# Altium project ZMBo.PrjPcb
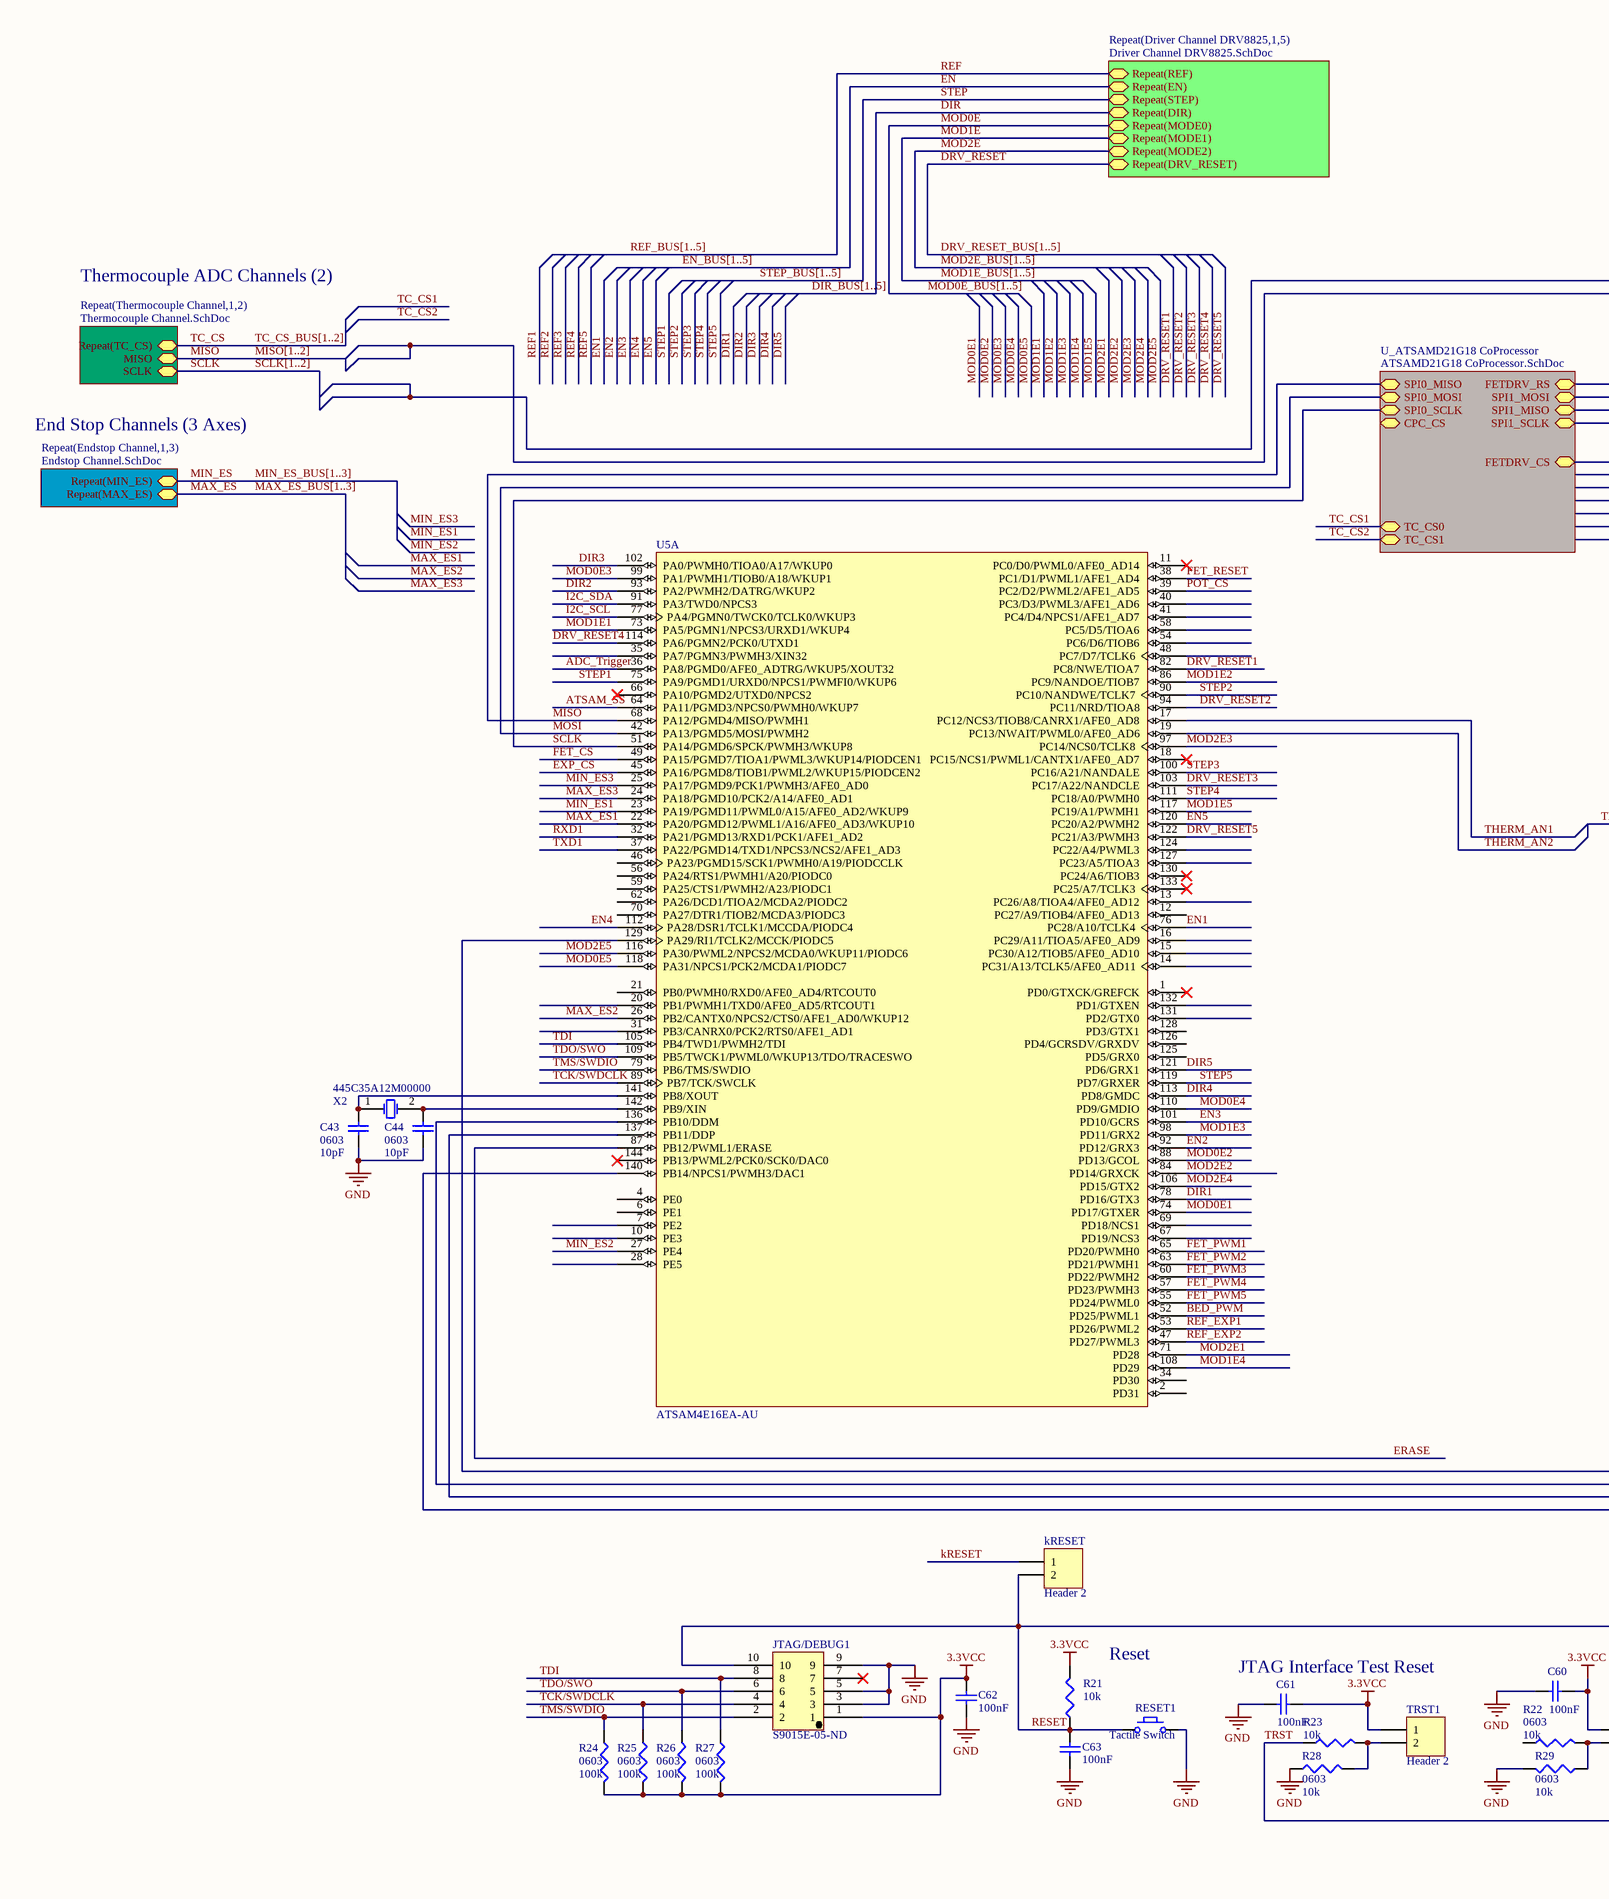
[diagram p0: ATSAM4E16EA_AU Main Controller.SchDoc, left]
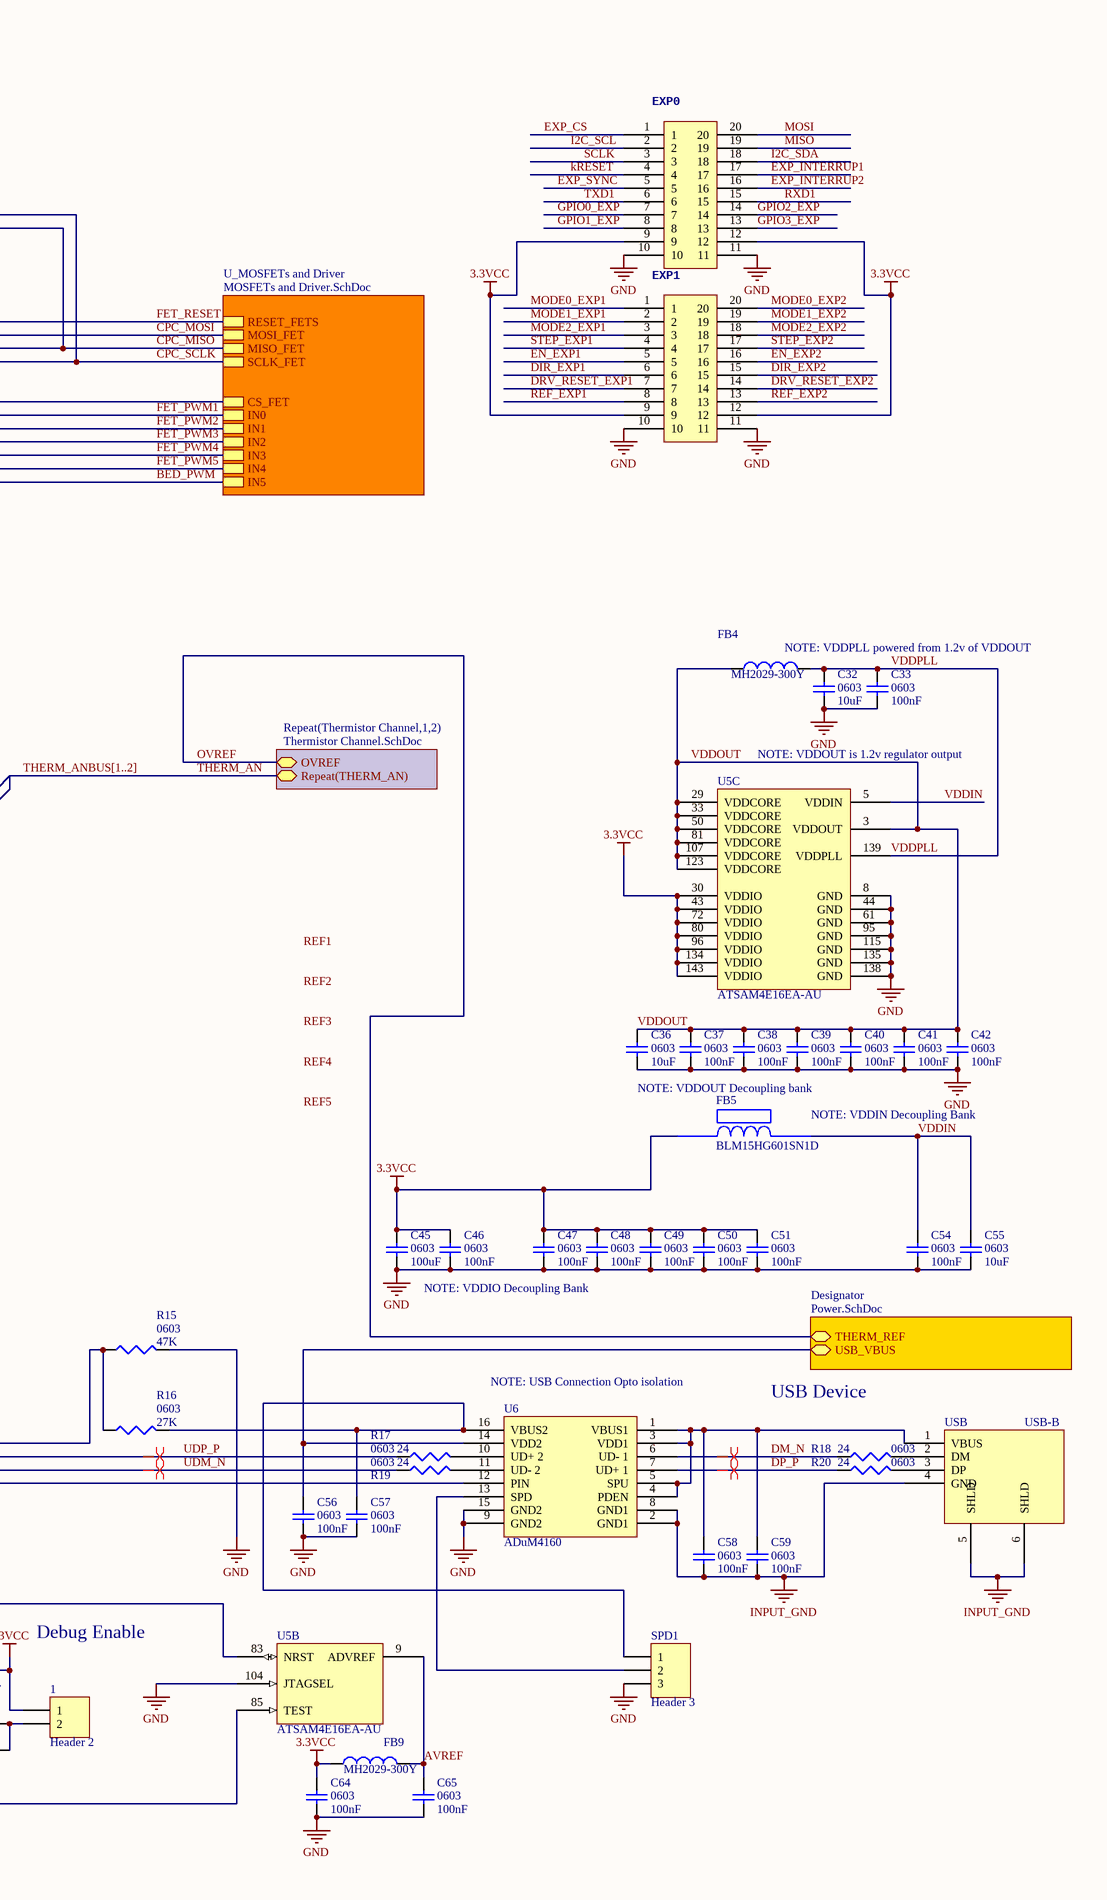
[diagram p1: ATSAM4E16EA_AU Main Controller.SchDoc, right]
8 sheets, 253 parts. Net scope: hierarchical (ports join the sheet entries above them; power ports are global).
Board file: Tigershark 3D R1.3.PcbDoc
Sheets:
  ATSAM4E16EA_AU Main Controller.SchDoc
    Thermistor Channel1 = Thermistor Channel.SchDoc
    Thermistor Channel2 = Thermistor Channel.SchDoc
    Designator = Power.SchDoc
    Thermocouple Channel1 = Thermocouple Channel.SchDoc
    Thermocouple Channel2 = Thermocouple Channel.SchDoc
    Endstop Channel1 = Endstop Channel.SchDoc
    Endstop Channel2 = Endstop Channel.SchDoc
    Endstop Channel3 = Endstop Channel.SchDoc
    Driver Channel DRV88251 = Driver Channel DRV8825.SchDoc
    Driver Channel DRV88252 = Driver Channel DRV8825.SchDoc
    Driver Channel DRV88253 = Driver Channel DRV8825.SchDoc
    Driver Channel DRV88254 = Driver Channel DRV8825.SchDoc
    Driver Channel DRV88255 = Driver Channel DRV8825.SchDoc
    U_MOSFETs and Driver = MOSFETs and Driver.SchDoc
    U_ATSAMD21G18 CoProcessor = ATSAMD21G18 CoProcessor.SchDoc

## Sheet ATSAM4E16EA_AU Main Controller.SchDoc
size C

### Parts
1  Header 2  [HDR1X2]
C32  0603  value 10uF  [1608[0603]]
C33  0603  value 100nF  [1608[0603]]
C36  0603  value 10uF  [1608[0603]]
C37  0603  value 100nF  [1608[0603]]
C38  0603  value 100nF  [1608[0603]]
C39  0603  value 100nF  [1608[0603]]
C40  0603  value 100nF  [1608[0603]]
C41  0603  value 100nF  [1608[0603]]
C42  0603  value 100nF  [1608[0603]]
C43  0603  value 10pF  [1608[0603]]
C44  0603  value 10pF  [1608[0603]]
C45  0603  value 100uF  [1608[0603]]
C46  0603  value 100nF  [1608[0603]]
C47  0603  value 100nF  [1608[0603]]
C48  0603  value 100nF  [1608[0603]]
C49  0603  value 100nF  [1608[0603]]
C50  0603  value 100nF  [1608[0603]]
C51  0603  value 100nF  [1608[0603]]
C54  0603  value 100nF  [1608[0603]]
C55  0603  value 10uF  [1608[0603]]
C56  0603  value 100nF  [1608[0603]]
C57  0603  value 100nF  [1608[0603]]
C58  0603  value 100nF  [1608[0603]]
C59  0603  value 100nF  [1608[0603]]
C60  value 100nF  [1608[0603]]  (hidden comment: Cap Semi)
C61  value 100nF  [1608[0603]]  (hidden comment: Cap Semi)
C62  value 100nF  [1608[0603]]  (hidden comment: Cap Semi)
C63  value 100nF  [1608[0603]]  (hidden comment: Cap Semi)
C64  0603  value 100nF  [1608[0603]]
C65  0603  value 100nF  [1608[0603]]
EXP0  10X2-0.1X0.05  [10X2-0.05X0.1]  (value not drawn)
EXP1  10X2-0.1X0.05  [10X2-0.05X0.1]  (value not drawn)
FB4  MH2029-300Y  [SM 0805 - gap trimmed]
FB5  BLM15HG601SN1D  [BLM18PG121SN1D]
FB9  MH2029-300Y  [SM 0805 - gap trimmed]
JTAG/DEBUG1  S9015E-05-ND  [S9015E-05-ND]
kRESET  Header 2  [HDR1X2]
R15  0603  value 47K  [J1-0603]
R16  0603  value 27K  [J1-0603]
R17  0603  value 24  [J1-0603]
R18  0603  value 24  [J1-0603]
R19  0603  value 24  [J1-0603]
R20  0603  value 24  [J1-0603]
R21  value 10k  [J1-0603]  (hidden comment: Res3)
R22  0603  value 10k  [J1-0603]
R23  value 10k  [J1-0603]  (hidden comment: Res3)
R24  0603  value 100k  [J1-0603]
R25  0603  value 100k  [J1-0603]
R26  0603  value 100k  [J1-0603]
R27  0603  value 100k  [J1-0603]
R28  0603  value 10k  [J1-0603]
R29  0603  value 10k  [J1-0603]
RESET1  Tactile Switch  [TL3301]
SPD1  Header 3  [HDR1X3]
TRST1  Header 2  [HDR1X2]
U5  ATSAM4E16EA-AU  [LQFP144_N]  (parts A,B,C of 3)
U6  ADuM4160  [ADuM4160]
USB  USB-B  [PN61729]
X2  445C35A12M00000  [445C35A12M00000]

### Sub-sheets
Designator = Power.SchDoc: USB_VBUS (bidir), THERM_REF
Repeat(Driver Channel DRV8825,1,5) = Driver Channel DRV8825.SchDoc: Repeat(REF), Repeat(EN), Repeat(STEP), Repeat(DIR), Repeat(MODE0), Repeat(MODE1), Repeat(MODE2), Repeat(DRV_RESET)
Repeat(Endstop Channel,1,3) = Endstop Channel.SchDoc: Repeat(MAX_ES), Repeat(MIN_ES)
Repeat(Thermistor Channel,1,2) = Thermistor Channel.SchDoc: OVREF, Repeat(THERM_AN)
Repeat(Thermocouple Channel,1,2) = Thermocouple Channel.SchDoc: SCLK, MISO, Repeat(TC_CS)
U_ATSAMD21G18 CoProcessor = ATSAMD21G18 CoProcessor.SchDoc: SPI0_MOSI, SPI0_MISO, SPI0_SCLK, CPC_CS, SPI1_MOSI, SPI1_MISO, SPI1_SCLK, TC_CS0, TC_CS1, FETDRV_CS, FETDRV_RS
U_MOSFETs and Driver = MOSFETs and Driver.SchDoc: RESET_FETS, MISO_FET, SCLK_FET, MOSI_FET, CS_FET, IN0, IN1, IN2, IN3, IN4, IN5

### Nets
3.3VCC: 1.1 C45.2 C46.2 C47.2 C48.2 C49.2 C50.2 C51.2 C60.2 C61.2 C62.2 C64.2 EXP0.9 EXP0.12 EXP1.9 EXP1.12 FB5.1 FB9.1 JTAG/DEBUG1.1 R21.2 R24.2 R25.2 R26.2 R27.2 TRST1.1 U5.30(VDDIO) U5.43(VDDIO) U5.72(VDDIO) U5.80(VDDIO) U5.96(VDDIO) U5.134(VDDIO) U5.143(VDDIO)
GND: C32.1 C33.1 C36.1 C37.1 C38.1 C39.1 C40.1 C41.1 C42.1 C43.1 C44.1 C45.1 C46.1 C47.1 C48.1 C49.1 C50.1 C51.1 C54.1 C55.1 C56.1 C57.1 C60.1 C61.1 C62.1 C63.1 C64.1 C65.1 EXP0.10 EXP0.11 EXP1.10 EXP1.11 JTAG/DEBUG1.3 JTAG/DEBUG1.5 JTAG/DEBUG1.9 R15.2 R28.1 R29.2 RESET1.2 SPD1.3 U5.8(GND) U5.44(GND) U5.61(GND) U5.95(GND) U5.104(JTAGSEL) U5.115(GND) U5.135(GND) U5.138(GND) U6.9(GND2) U6.15(GND2)
INPUT_GND: C58.1 C59.1 U6.2(GND1) U6.8(GND1) USB.4(GND) USB.5(SHLD) USB.6(SHLD)
ADC_Trigger: U5.36(PA8/PGMD0/AFE0_ADTRG/WKUP5/XOUT32)
ATSAM_SS: U5.64(PA11/PGMD3/NPCS0/PWMH0/WKUP7)
AVREF: C65.2 FB9.2 U5.9(ADVREF)
BED_PWM: U5.52(PD25/PWML1) ; sheet U_MOSFETs and Driver/IN5
CPC_MISO: sheet U_MOSFETs and Driver/MISO_FET, sheet U_ATSAMD21G18 CoProcessor/SPI1_MISO
CPC_MOSI: sheet U_MOSFETs and Driver/MOSI_FET, sheet U_ATSAMD21G18 CoProcessor/SPI1_MOSI
CPC_SCLK: sheet U_MOSFETs and Driver/SCLK_FET, sheet U_ATSAMD21G18 CoProcessor/SPI1_SCLK
DIR: sheet Repeat(Driver Channel DRV8825,1,5)/Repeat(DIR)
DIR1: U5.78(PD16/GTX3)
DIR2: U5.93(PA2/PWMH2/DATRG/WKUP2)
DIR3: U5.102(PA0/PWMH0/TIOA0/A17/WKUP0)
DIR4: U5.113(PD8/GMDC)
DIR5: U5.121(PD6/GRX1)
DIR_EXP1: EXP1.6
DIR_EXP2: EXP1.15
DM_N: R18.1 U6.6(UD-_1)
DP_P: R20.1 U6.7(UD+_1)
DRV_RESET: sheet Repeat(Driver Channel DRV8825,1,5)/Repeat(DRV_RESET)
DRV_RESET1: U5.82(PC8/NWE/TIOA7)
DRV_RESET2: U5.94(PC11/NRD/TIOA8)
DRV_RESET3: U5.103(PC17/A22/NANDCLE)
DRV_RESET4: U5.114(PA6/PGMN2/PCK0/UTXD1)
DRV_RESET5: U5.122(PC21/A3/PWMH3)
DRV_RESET_EXP1: EXP1.7
DRV_RESET_EXP2: EXP1.14
EN: sheet Repeat(Driver Channel DRV8825,1,5)/Repeat(EN)
EN1: U5.76(PC28/A10/TCLK4)
EN2: U5.92(PD12/GRX3)
EN3: U5.101(PD10/GCRS)
EN4: U5.112(PA28/DSR1/TCLK1/MCCDA/PIODC4)
EN5: U5.120(PC20/A2/PWMH2)
EN_EXP1: EXP1.5
EN_EXP2: EXP1.16
ERASE: U5.87(PB12/PWML1/ERASE)
EXP_CS: EXP0.1 U5.45(PA16/PGMD8/TIOB1/PWML2/WKUP15/PIODCEN2)
EXP_INTERRUP1: EXP0.17
EXP_INTERRUP2: EXP0.16
EXP_SYNC: EXP0.5
FET_CS: U5.49(PA15/PGMD7/TIOA1/PWML3/WKUP14/PIODCEN1)
FET_PWM1: U5.65(PD20/PWMH0) ; sheet U_MOSFETs and Driver/IN0
FET_PWM2: U5.63(PD21/PWMH1) ; sheet U_MOSFETs and Driver/IN1
FET_PWM3: U5.60(PD22/PWMH2) ; sheet U_MOSFETs and Driver/IN2
FET_PWM4: U5.57(PD23/PWMH3) ; sheet U_MOSFETs and Driver/IN3
FET_PWM5: U5.55(PD24/PWML0) ; sheet U_MOSFETs and Driver/IN4
FET_RESET: U5.38(PC1/D1/PWML1/AFE1_AD4) ; sheet U_MOSFETs and Driver/RESET_FETS, sheet U_ATSAMD21G18 CoProcessor/FETDRV_RS
GPIO0_EXP: EXP0.7
GPIO1_EXP: EXP0.8
GPIO2_EXP: EXP0.14
GPIO3_EXP: EXP0.13
I2C_SCL: EXP0.2 U5.77(PA4/PGMN0/TWCK0/TCLK0/WKUP3)
I2C_SDA: EXP0.18 U5.91(PA3/TWD0/NPCS3)
kRESET: EXP0.4 kRESET.1
MAX_ES: sheet Repeat(Endstop Channel,1,3)/Repeat(MAX_ES)
MAX_ES1: U5.22(PA20/PGMD12/PWML1/A16/AFE0_AD3/WKUP10)
MAX_ES2: U5.26(PB2/CANTX0/NPCS2/CTS0/AFE1_AD0/WKUP12)
MAX_ES3: U5.24(PA18/PGMD10/PCK2/A14/AFE0_AD1)
MIN_ES: sheet Repeat(Endstop Channel,1,3)/Repeat(MIN_ES)
MIN_ES1: U5.23(PA19/PGMD11/PWML0/A15/AFE0_AD2/WKUP9)
MIN_ES2: U5.27(PE4)
MIN_ES3: U5.25(PA17/PGMD9/PCK1/PWMH3/AFE0_AD0)
MISO: EXP0.19 U5.68(PA12/PGMD4/MISO/PWMH1) ; sheet Repeat(Thermocouple Channel,1,2)/MISO, sheet U_ATSAMD21G18 CoProcessor/SPI0_MISO
MOD0E: sheet Repeat(Driver Channel DRV8825,1,5)/Repeat(MODE0)
MOD0E1: U5.74(PD17/GTXER)
MOD0E2: U5.88(PD13/GCOL)
MOD0E3: U5.99(PA1/PWMH1/TIOB0/A18/WKUP1)
MOD0E4: U5.110(PD9/GMDIO)
MOD0E5: U5.118(PA31/NPCS1/PCK2/MCDA1/PIODC7)
MOD1E: sheet Repeat(Driver Channel DRV8825,1,5)/Repeat(MODE1)
MOD1E1: U5.73(PA5/PGMN1/NPCS3/URXD1/WKUP4)
MOD1E2: U5.86(PC9/NANDOE/TIOB7)
MOD1E3: U5.98(PD11/GRX2)
MOD1E4: U5.108(PD29)
MOD1E5: U5.117(PC19/A1/PWMH1)
MOD2E: sheet Repeat(Driver Channel DRV8825,1,5)/Repeat(MODE2)
MOD2E1: U5.71(PD28)
MOD2E2: U5.84(PD14/GRXCK)
MOD2E3: U5.97(PC14/NCS0/TCLK8)
MOD2E4: U5.106(PD15/GTX2)
MOD2E5: U5.116(PA30/PWML2/NPCS2/MCDA0/WKUP11/PIODC6)
MODE0_EXP1: EXP1.1
MODE0_EXP2: EXP1.20
MODE1_EXP1: EXP1.2
MODE1_EXP2: EXP1.19
MODE2_EXP1: EXP1.3
MODE2_EXP2: EXP1.18
MOSI: EXP0.20 U5.42(PA13/PGMD5/MOSI/PWMH2) ; sheet U_ATSAMD21G18 CoProcessor/SPI0_MOSI
OVREF: sheet Repeat(Thermistor Channel,1,2)/OVREF, sheet Designator/THERM_REF
POT_CS: U5.39(PC2/D2/PWML2/AFE1_AD5)
REF: sheet Repeat(Driver Channel DRV8825,1,5)/Repeat(REF)
REF_EXP1: EXP1.8 U5.53(PD26/PWML2)
REF_EXP2: EXP1.13 U5.47(PD27/PWML3)
RESET: C63.2 JTAG/DEBUG1.10 kRESET.2 R21.1 RESET1.1 U5.83(NRST)
RXD1: EXP0.15 U5.32(PA21/PGMD13/RXD1/PCK1/AFE1_AD2)
SCLK: EXP0.3 U5.51(PA14/PGMD6/SPCK/PWMH3/WKUP8) ; sheet Repeat(Thermocouple Channel,1,2)/SCLK, sheet U_ATSAMD21G18 CoProcessor/SPI0_SCLK
STEP: sheet Repeat(Driver Channel DRV8825,1,5)/Repeat(STEP)
STEP1: U5.75(PA9/PGMD1/URXD0/NPCS1/PWMFI0/WKUP6)
STEP2: U5.90(PC10/NANDWE/TCLK7)
STEP3: U5.100(PC16/A21/NANDALE)
STEP4: U5.111(PC18/A0/PWMH0)
STEP5: U5.119(PD7/GRXER)
STEP_EXP1: EXP1.4
STEP_EXP2: EXP1.17
TC_CS: sheet Repeat(Thermocouple Channel,1,2)/Repeat(TC_CS)
TCK/SWDCLK: JTAG/DEBUG1.4 R25.1 U5.89(PB7/TCK/SWCLK)
TDI: JTAG/DEBUG1.8 R27.1 U5.105(PB4/TWD1/PWMH2/TDI)
TDO/SWO: JTAG/DEBUG1.6 R26.1 U5.109(PB5/TWCK1/PWML0/WKUP13/TDO/TRACESWO)
THERM_AN: sheet Repeat(Thermistor Channel,1,2)/Repeat(THERM_AN)
THERM_AN1: U5.17(PC12/NCS3/TIOB8/CANRX1/AFE0_AD8)
THERM_AN2: U5.19(PC13/NWAIT/PWML0/AFE0_AD6)
TMS/SWDIO: JTAG/DEBUG1.2 R24.1 U5.79(PB6/TMS/SWDIO)
TRST: R23.1 U5.85(TEST)
TXD1: EXP0.6 U5.37(PA22/PGMD14/TXD1/NPCS3/NCS2/AFE1_AD3)
UDM_N: R19.1 U5.137(PB11/DDP)
UDP_P: R17.1 U5.136(PB10/DDM)
VDDIN: C54.2 C55.2 FB5.2 U5.5(VDDIN)
VDDOUT: C36.2 C37.2 C38.2 C39.2 C40.2 C41.2 C42.2 FB4.1 U5.3(VDDOUT) U5.29(VDDCORE) U5.33(VDDCORE) U5.50(VDDCORE) U5.81(VDDCORE) U5.107(VDDCORE) U5.123(VDDCORE)
VDDPLL: C32.2 C33.2 FB4.2 U5.139(VDDPLL)
Net1_2: 1.2 R22.2 R29.1
NetC43_2: C43.2 U5.141(PB8/XOUT) X2.1(OSC1)
NetC44_2: C44.2 U5.142(PB9/XIN) X2.2(OSC2)
NetC56_2: C56.2 U6.14(VDD2) ; sheet Designator/USB_VBUS
NetC57_2: C57.2 R16.2 SPD1.1 U6.16(VBUS2)
NetC58_2: C58.2 C59.2 U6.1(VBUS1) U6.3(VDD1) U6.4(PDEN) U6.5(SPU) USB.1(VBUS)
NetR15_1: R15.1 R16.1 U5.129(PA29/RI1/TCLK2/MCCK/PIODC5)
NetR17_2: R17.2 U6.10(UD+_2)
NetR18_2: R18.2 USB.2(DM)
NetR19_2: R19.2 U6.11(UD-_2)
NetR20_2: R20.2 USB.3(DP)
NetR23_2: R23.2 R28.2 TRST1.2
NetSPD1_2: SPD1.2 U6.13(SPD)
NetU5_140: U5.140(PB14/NPCS1/PWMH3/DAC1) U6.12(PIN)
NetU10_23: sheet U_MOSFETs and Driver/CS_FET, sheet U_ATSAMD21G18 CoProcessor/FETDRV_CS

Not connected (* = marked no-connect by the designer): JTAG/DEBUG1 7*; R22 1; U5 1(PD0/GTXCK/GREFCK)* 2(PD31) 4(PE0) 6(PE1) 7(PE2) 10(PE3) 11(PC0/D0/PWML0/AFE0_AD14)* 12(PC27/A9/TIOB4/AFE0_AD13) 13(PC26/A8/TIOA4/AFE0_AD12) 14(PC31/A13/TCLK5/AFE0_AD11) 15(PC30/A12/TIOB5/AFE0_AD10) 16(PC29/A11/TIOA5/AFE0_AD9) 18(PC15/NCS1/PWML1/CANTX1/AFE0_AD7)* 20(PB1/PWMH1/TXD0/AFE0_AD5/RTCOUT1) 21(PB0/PWMH0/RXD0/AFE0_AD4/RTCOUT0) 28(PE5) 31(PB3/CANRX0/PCK2/RTS0/AFE1_AD1) 34(PD30) 35(PA7/PGMN3/PWMH3/XIN32) 40(PC3/D3/PWML3/AFE1_AD6) 41(PC4/D4/NPCS1/AFE1_AD7) 46(PA23/PGMD15/SCK1/PWMH0/A19/PIODCCLK) 48(PC7/D7/TCLK6) 54(PC6/D6/TIOB6) 56(PA24/RTS1/PWMH1/A20/PIODC0) 58(PC5/D5/TIOA6) 59(PA25/CTS1/PWMH2/A23/PIODC1) 62(PA26/DCD1/TIOA2/MCDA2/PIODC2) 66(PA10/PGMD2/UTXD0/NPCS2)* 67(PD19/NCS3) 69(PD18/NCS1) 70(PA27/DTR1/TIOB2/MCDA3/PIODC3) 124(PC22/A4/PWML3) 125(PD5/GRX0) 126(PD4/GCRSDV/GRXDV) 127(PC23/A5/TIOA3) 128(PD3/GTX1) 130(PC24/A6/TIOB3)* 131(PD2/GTX0) 132(PD1/GTXEN) 133(PC25/A7/TCLK3)* 144(PB13/PWML2/PCK0/SCK0/DAC0)*

### Buses and harness runs
bus DIR_BUS[1..5]
bus DRV_RESET_BUS[1..5]
bus EN_BUS[1..5]
bus MAX_ES_BUS[1..3]
bus MIN_ES_BUS[1..3]
bus MISO[1..2]
bus MOD0E_BUS[1..5]
bus MOD1E_BUS[1..5]
bus MOD2E_BUS[1..5]
bus REF_BUS[1..5]
bus SCLK[1..2]
bus STEP_BUS[1..5]
bus TC_CS_BUS[1..2]
bus THERM_ANBUS[1..2]

### Layout directives
differential pair: DM_N, DP_P, UDM_N, UDP_P

### Notes on the sheet
- Thermocouple ADC Channels (2)
- End Stop Channels (3 Axes)
- (near FB4) NOTE: VDDPLL powered from 1.2v of VDDOUT
- NOTE: VDDOUT is 1.2v regulator output
- NOTE: VDDOUT Decoupling bank
- NOTE: VDDIN Decoupling Bank
- NOTE: VDDIO Decoupling Bank
- (near U6) NOTE: USB Connection Opto isolation
- USB Device
- Reset
- (near C61) JTAG Interface Test Reset
- Debug Enable
- Labels drawn without touching a wire or pin: REF1, REF2, REF3, REF4, REF5

### Library data of the parts
1 kRESET TRST1 = Header 2: Header, 2-Pin; LatestRevisionDate: 17-Jul-2002; LatestRevisionNote: Re-released for DXP Platform.; Publisher: Altium Limited
C32 C33 C36-C51 C54-C65 = Cap Semi: Capacitor (Semiconductor SIM Model); Published: 8-Jun-2000; LatestRevisionDate: 29-May-2009; LatestRevisionNote: IPC-7351 Footprint Added.; PackageReference: C1206; Publisher: Altium Limited; PackageDescription: Chip Capacitor
EXP0 EXP1 = 10X2-0.1X0.05: LastRevisionNote: ImportComponents; Published: 23-Apr-2014; Publisher: UltiMachine; LastRevisionDate: 23-Apr-2014
FB4 FB9 = Inductor: Code_IEC: 1005; Published: 8-Jun-2000; LatestRevisionDate: 17-Jul-2002; LatestRevisionNote: Re-released for DXP Platform.; PackageReference: 0402-A; Publisher: Altium Limited; Code_JEITA: 0402
R15-R29 = Res3: Resistor; Published: 8-Jun-2000; LatestRevisionDate: 29-May-2009; LatestRevisionNote: IPC-7351 Footprint Added.; PackageReference: J1-0603; Publisher: Altium Limited; PackageDescription: Chip Resistor
SPD1 = Header 3: Header, 3-Pin; LatestRevisionDate: 17-Jul-2002; LatestRevisionNote: Re-released for DXP Platform.; Publisher: Altium Limited
U5 = ATML-ATSAM4EXEA-LQFP-144
U6 = ADuM4160: USB Opto Isolator
X2 = XTAL: Crystal Oscillator; Published: 8-Jun-2000; LatestRevisionDate: 17-Jul-2002; LatestRevisionNote: Re-released for DXP Platform.; PackageReference: R38; Publisher: Altium Limited; PackageDescription: Crystal, Thru-Hole; 2 Leads; Body 3.1 x 8.2 mm (Dia.xH)

## Sheet Thermistor Channel.SchDoc
size A
Used 2 times, as channels Thermistor Channel1, Thermistor Channel2. Parts and nets are listed once, with the designators drawn on the sheet.
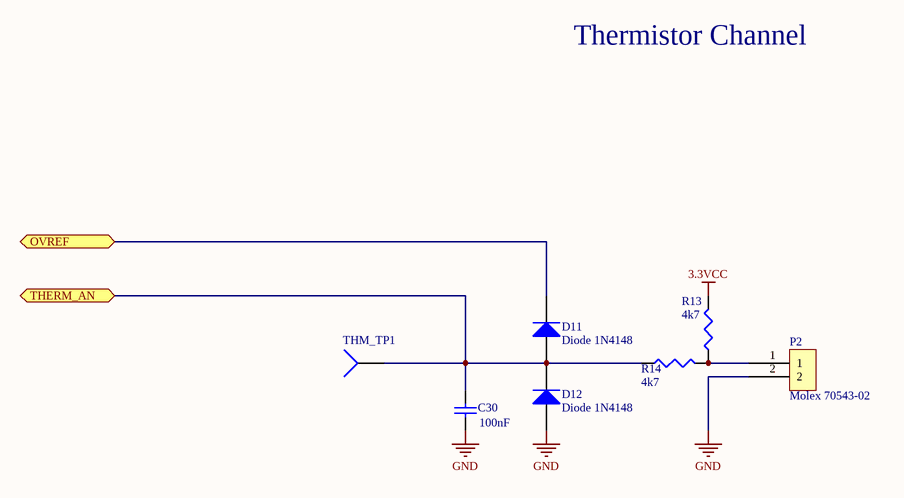
[diagram p2: Thermistor Channel.SchDoc]

### Parts
C30  value 100nF  [1608[0603]]  (hidden comment: Cap Semi)
D11  Diode 1N4148  [1N4148WT]
D12  Diode 1N4148  [1N4148WT]
P2  Molex 70543-02  [70543-02]
R13  value 4k7  [J1-0603]  (hidden comment: Res3)
R14  value 4k7  [J1-0603]  (hidden comment: Res3)
THM_TP1  TP4  [PIN1]  (value not drawn)

### Ports
OVREF, THERM_AN

### Nets
3.3VCC: R13.2
GND: C30.1 D12.1(A) P2.2
OVREF: D11.2(K) ; port OVREF
THERM_AN: C30.2 D11.1(A) D12.2(K) R14.1 THM_TP1.1 ; port THERM_AN
NetP2_1: P2.1 R13.1 R14.2

### Channels
Thermistor Channel1: designators end in _ThermistorChannel1; ports OVREF=OVREF THERM_AN=THERM_AN1
Thermistor Channel2: designators end in _ThermistorChannel2; ports OVREF=OVREF THERM_AN=THERM_AN2

### Notes on the sheet
- Thermistor Channel

### Library data of the parts
C30 = Cap Semi: Capacitor (Semiconductor SIM Model); Published: 8-Jun-2000; LatestRevisionDate: 29-May-2009; LatestRevisionNote: IPC-7351 Footprint Added.; PackageReference: C1206; Publisher: Altium Limited; PackageDescription: Chip Capacitor
D11 D12 = Diode 1N4148: High Conductance Fast Diode; Published: 8-Jun-2000; LatestRevisionDate: 17-Jul-2002; LatestRevisionNote: Re-released for DXP Platform.; DatasheetVersion: 1997; PackageReference: DO-35; Publisher: Altium Limited; PackageDescription: Diode, Axial; Body 3.8 x 1.9 mm (LxDia. max), Lead Dia. 0.53 mm (max); Code_JEDEC: DO-204-AH; ComponentLink1Description: Manufacturer Link; ComponentLink1URL: http://www.fairchildsemi.com/; ComponentLink2Description: Datasheet; ComponentLink2URL: http://www.fairchildsemi.com/ds/1N%2F1N4148.pdf
R13 R14 = Res3: Resistor; Published: 8-Jun-2000; LatestRevisionDate: 29-May-2009; LatestRevisionNote: IPC-7351 Footprint Added.; PackageReference: J1-0603; Publisher: Altium Limited; PackageDescription: Chip Resistor
THM_TP1 = Socket: LatestRevisionDate: 17-Jul-2002; LatestRevisionNote: Re-released for DXP Platform.; Publisher: Altium Limited

## Sheet Power.SchDoc
size B
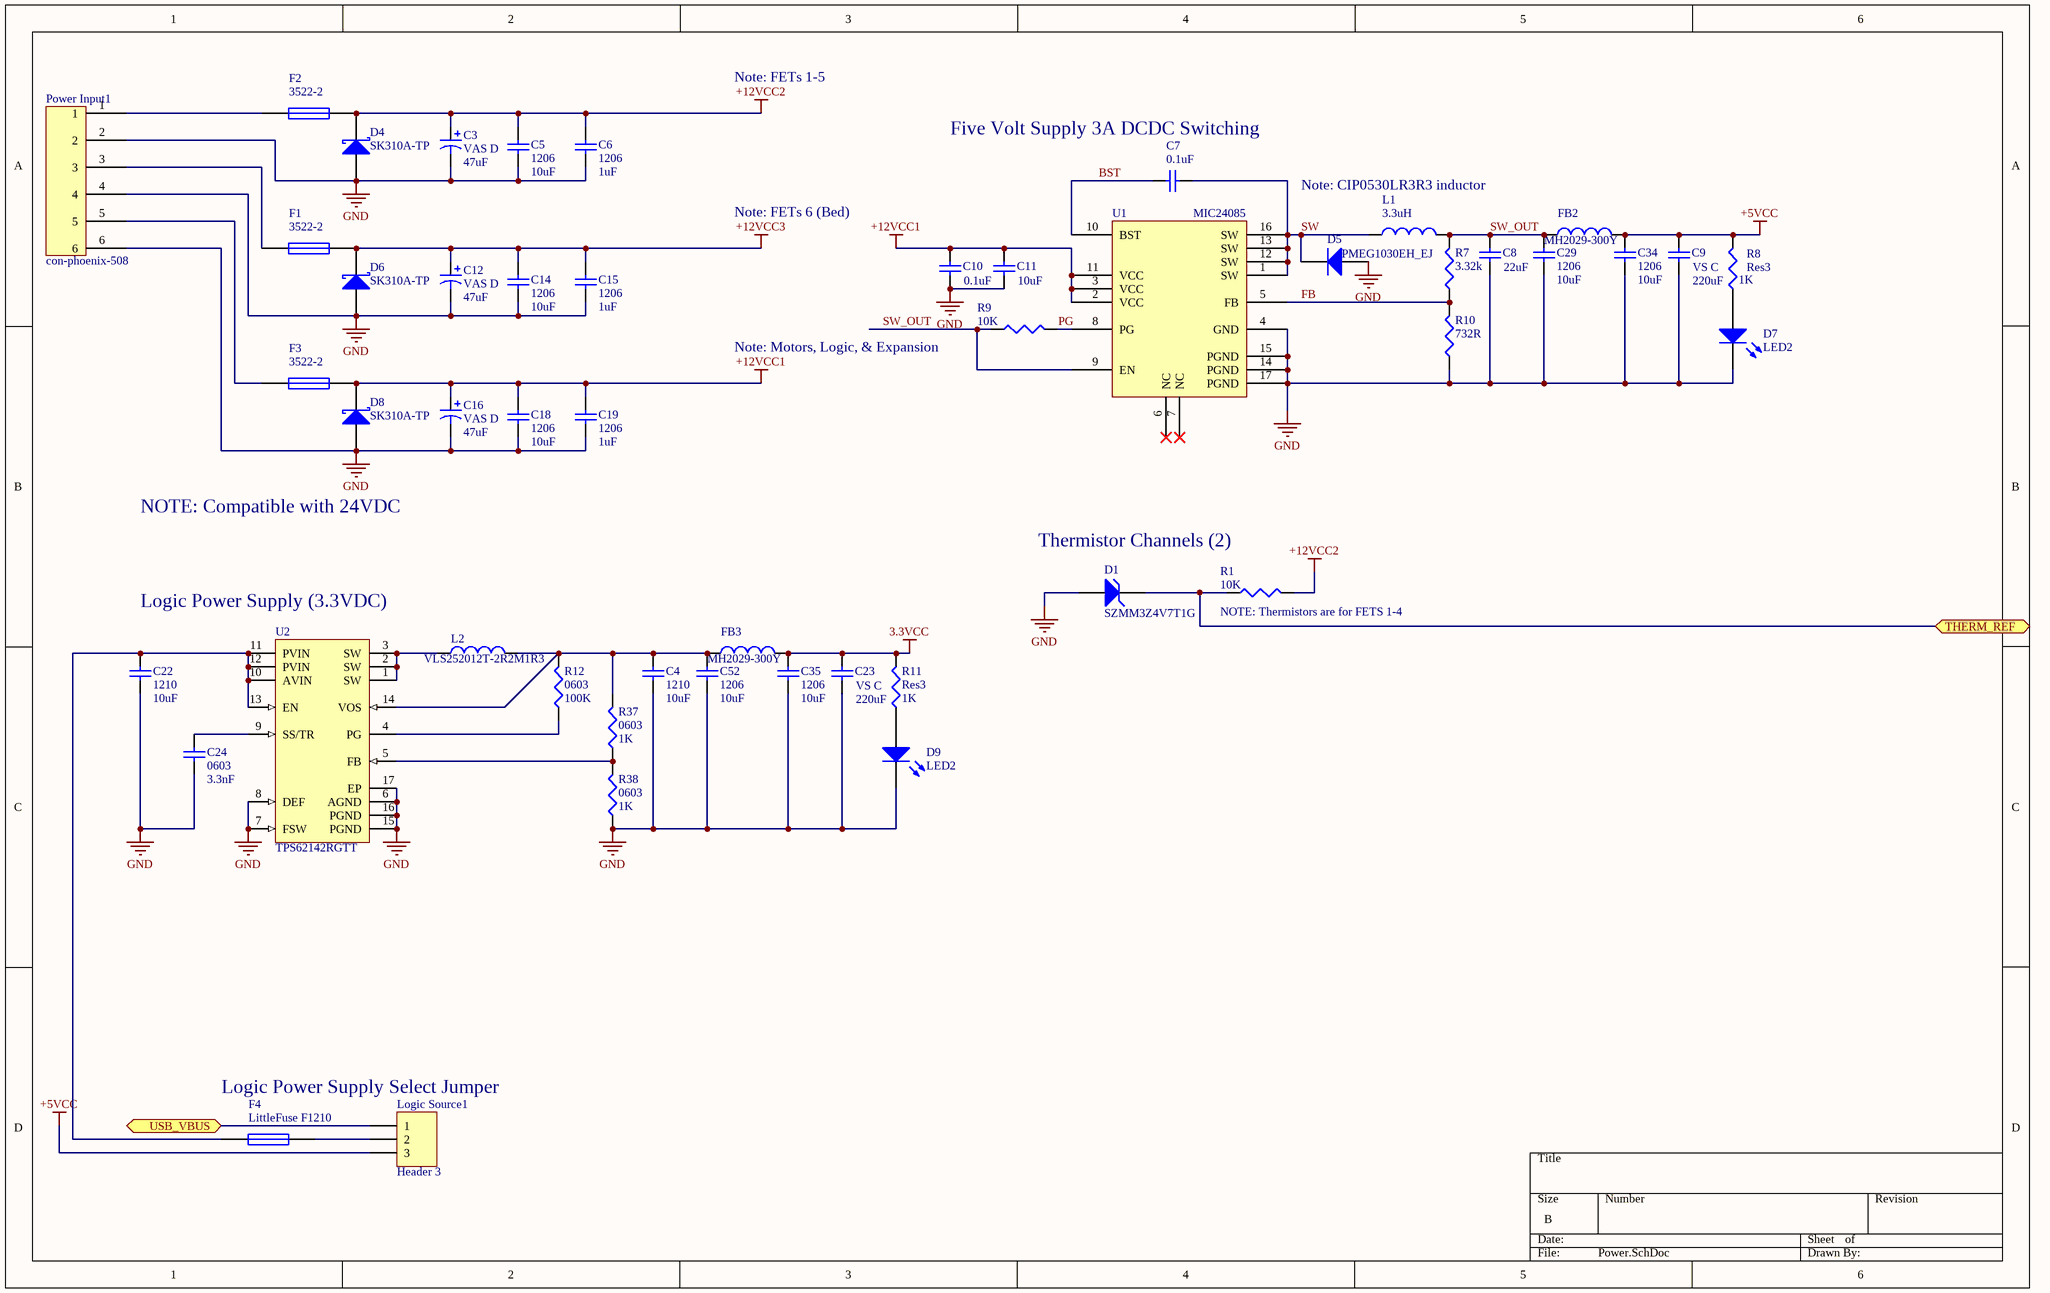
[diagram p3: Power.SchDoc]

### Parts
C3  VAS D  value 47uF  [Panasonic VS D]
C4  1210  value 10uF  [C1210]
C5  1206  value 10uF  [C1206]
C6  1206  value 1uF  [C1206]
C7  value 0.1uF  [1608[0603]]  (hidden comment: Cap Semi)
C8  value 22uF  [C1206]  (hidden comment: Cap Semi)
C9  VS C  value 220uF  [Panasonic VS C]
C10  value 0.1uF  [C1206]  (hidden comment: Cap Semi)
C11  value 10uF  [1608[0603]]  (hidden comment: Cap Semi)
C12  VAS D  value 47uF  [Panasonic VS D]
C14  1206  value 10uF  [C1206]
C15  1206  value 1uF  [C1206]
C16  VAS D  value 47uF  [Panasonic VS D]
C18  1206  value 10uF  [C1206]
C19  1206  value 1uF  [C1206]
C22  1210  value 10uF  [C1210]
C23  VS C  value 220uF  [Panasonic VS C]
C24  0603  value 3.3nF  [1608[0603]]
C29  1206  value 10uF  [C1206]
C34  1206  value 10uF  [C1206]
C35  1206  value 10uF  [C1206]
C52  1206  value 10uF  [C1206]
D1  SZMM3Z4V7T1G  [SZMM3Z4V7T1G]
D4  SK310A-TP  [SK310A-TP]
D5  PMEG1030EH_EJ  [PMEG1030EH_EJ]
D6  SK310A-TP  [SK310A-TP]
D7  LED2  [SM 0805 polarized]
D8  SK310A-TP  [SK310A-TP]
D9  LED2  [SM 0805 polarized]
F1  3522-2  [3522-2]
F2  3522-2  [3522-2]
F3  3522-2  [3522-2]
F4  LittleFuse F1210  [F1210_M]
FB2  MH2029-300Y  [SM 0805 - gap trimmed]
FB3  MH2029-300Y  [SM 0805 - gap trimmed]
L1  value 3.3uH  [CIP0530LR3R3]  (hidden comment: Inductor)
L2  VLS252012T-2R2M1R3  [VLS252012T-2R2M1R3]
Logic_Source1  Header 3  [HDR1X3]
Power_Input1  con-phoenix-508  [MSTBV6]
R1  value 10K  [J1-0603]  (hidden comment: Res3)
R7  value 3.32k  [J1-0603]  (hidden comment: Res3)
R8  Res3  value 1K  [SM 0805 - gap trimmed]
R9  value 10K  [J1-0603]  (hidden comment: Res3)
R10  value 732R  [J1-0603]  (hidden comment: Res3)
R11  Res3  value 1K  [SM 0805 - gap trimmed]
R12  0603  value 100K  [J1-0603]
R37  0603  value 1K  [J1-0603]
R38  0603  value 1K  [J1-0603]
U1  MIC24085  [MIC24085-AYML]
U2  TPS62142RGTT  [RGT16-1700X1700TP]

### Ports
THERM_REF, USB_VBUS (bidir)

### Nets
3.3VCC: C23.1 C35.1 FB3.2 R11.2
+5VCC: C9.1 C34.1 FB2.2 Logic_Source1.3 R8.2
+12VCC1: C10.2 C11.2 C16.1 C18.2 C19.2 D8.2(K) F3.2 U1.2(VCC) U1.3(VCC) U1.11(VCC)
+12VCC2: C3.1 C5.2 C6.2 D4.2(K) F2.2 R1.2
+12VCC3: C12.1 C14.2 C15.2 D6.2(K) F1.2
GND: C3.2 C4.2 C5.1 C6.1 C8.1 C9.2 C10.1 C11.1 C12.2 C14.1 C15.1 C16.2 C18.1 C19.1 C22.2 C23.2 C24.1 C29.2 C34.2 C35.2 C52.2 D1.1(A) D4.1(A) D5.1(A) D6.1(A) D7.1(A) D8.1(A) D9.1(A) Power_Input1.2 Power_Input1.4 Power_Input1.6 R10.1 R38.1 U1.4(GND) U1.14(PGND) U1.15(PGND) U1.17(PGND) U2.6(AGND) U2.7(FSW) U2.8(DEF) U2.15(PGND) U2.16(PGND) U2.17(EP)
BST: C7.2 U1.10(BST)
FB: R7.1 R10.2 U1.5(FB)
OVREF: D1.2(K) R1.1 ; port THERM_REF
PG: R9.2 U1.8(PG)
SW: C7.1 D5.2(K) L1.1 U1.1(SW) U1.12(SW) U1.13(SW) U1.16(SW)
SW_OUT: C8.2 C29.1 FB2.1 L1.2 R7.2 R9.1 U1.9(EN)
NetC4_1: C4.1 C52.1 FB3.1 L2.2 R12.2 R37.2 U2.14(VOS)
NetC22_1: C22.1 F4.1 U2.10(AVIN) U2.11(PVIN) U2.12(PVIN) U2.13(EN)
NetC24_2: C24.2 U2.9(SS/TR)
NetC56_2: Logic_Source1.1 ; port USB_VBUS
NetD7_2: D7.2(K) R8.1
NetD9_2: D9.2(K) R11.1
NetF1_1: F1.1 Power_Input1.3
NetF2_1: F2.1 Power_Input1.1
NetF3_1: F3.1 Power_Input1.5
NetF4_2: F4.2 Logic_Source1.2
NetL2_1: L2.1 U2.1(SW) U2.2(SW) U2.3(SW)
NetR12_1: R12.1 U2.4(PG)
NetR37_1: R37.1 R38.2 U2.5(FB)

Not connected (* = marked no-connect by the designer): U1 6(NC)* 7(NC)*

### Notes on the sheet
- Note: FETs 1-5
- (near C7) Five Volt Supply 3A DCDC Switching
- Note: FETs 6 (Bed)
- Note: CIP0530LR3R3 inductor
- (near R9) Note: Motors, Logic, & Expansion
- NOTE: Compatible with 24VDC
- Thermistor Channels (2)
- Logic Power Supply (3.3VDC)
- (near R1) NOTE: Thermistors are for FETS 1-4
- Logic Power Supply Select Jumper

### Library data of the parts
C3 C12 C16 = Cap Pol1: Polarized Capacitor (Radial); Published: 8-Jun-2000; LatestRevisionDate: 17-Jul-2002; LatestRevisionNote: Re-released for DXP Platform.; PackageReference: RB7.6-15; Publisher: Altium Limited; PackageDescription: Polarized Capacitor (Radial); 2 Leads
C4-C11 C14 C15 C18 C19 C22-C24 C29 C34 C35 C52 = Cap Semi: Capacitor (Semiconductor SIM Model); Published: 8-Jun-2000; LatestRevisionDate: 29-May-2009; LatestRevisionNote: IPC-7351 Footprint Added.; PackageReference: C1206; Publisher: Altium Limited; PackageDescription: Chip Capacitor
D1 = D Zener: Zener Diode; Published: 8-Jun-2000; LatestRevisionDate: 17-Jul-2002; LatestRevisionNote: Re-released for DXP Platform.; PackageReference: DIODE-0.7; Publisher: Altium Limited; PackageDescription: Diode, Thru-Hole; 2 Leads; 0.7 in Pin Spacing
D4 D6 D8 = D Schottky: Schottky Diode; Published: 8-Jun-2000; LatestRevisionDate: 17-Jul-2002; LatestRevisionNote: Re-released for DXP Platform.; PackageReference: SMB; Publisher: Altium Limited; PackageDescription: DO-214-AA/SMB; 2 C-Bend Leads; Body 5.3 x 3.6 mm, inc. leads (LxW); Code_JEDEC: DO-214-AA
D5 = PMEG1030EH_EJ: Default Diode; Published: 8-Jun-2000; LatestRevisionDate: 17-Jul-2002; LatestRevisionNote: Re-released for DXP Platform.; PackageVersion: Sep-1996; PackageReference: SMC; Publisher: Altium Limited; PackageDescription: DO-214-AB/SMC; 2 C-Bend Leads; Body 7.9 x 5.9 mm, inc. leads (LxW); Code_JEDEC: DO-214-AB
D7 D9 = LED2: Typical RED, GREEN, YELLOW, AMBER GaAs LED; Published: 8-Jun-2000; LatestRevisionDate: 17-Jul-2002; LatestRevisionNote: Re-released for DXP Platform.; PackageVersion: Feb-2002; PackageReference: 3.2X1.6X1.1; Publisher: Altium Limited; PackageDescription: SM LED; 2 Flat Leads
F1-F4 = Fuse 1: Fuse; Published: 8-Jun-2000; LatestRevisionDate: 17-Jul-2002; LatestRevisionNote: Re-released for DXP Platform.; PackageReference: PIN-W2/E2.8; Publisher: Altium Limited; PackageDescription: Thru-Hole; 2 Leads
FB2 FB3 L1 L2 = Inductor: Code_IEC: 1005; Published: 8-Jun-2000; PackageReference: 0402-A; Publisher: Altium Limited; Code_JEITA: 0402
  FB2 FB3 L2: LatestRevisionDate: 17-Jul-2002; LatestRevisionNote: Re-released for DXP Platform.
  L1: LatestRevisionDate: 29-May-2009; LatestRevisionNote: IPC-7351 Footprint Added.; PackageDescription: Chip Inductor
Logic_Source1 = Header 3: Header, 3-Pin; LatestRevisionDate: 17-Jul-2002; LatestRevisionNote: Re-released for DXP Platform.; Publisher: Altium Limited
R1 R7-R12 R37 R38 = Res3: Resistor; Published: 8-Jun-2000; LatestRevisionDate: 29-May-2009; LatestRevisionNote: IPC-7351 Footprint Added.; PackageReference: J1-0603; Publisher: Altium Limited; PackageDescription: Chip Resistor
U2 = TPS62142RGTT: Buck Step Down Regulator with 3 to 17 V Input and 3.3 V Output, -40 to 85 degC, 16-Pin QFN (RGT), Green (RoHS & no Sb/Br); Manufacturer: Texas Instruments; Duty Cycle(Max)(%): 100; Iout(Max)(A): 2; Iq(Typ)(mA): 0.017; Preset Vout(V): 3.3; Rating: Catalog; Regulated Outputs(#): 1; SubFamily: Step-Down Regulator; Switch Current Limit(Typ)(A): 3; Synchronous Rectification: TRUE; Vin(Max)(V): 17; DatasheetVersion: SLVSAJ0; PackageVersion: revH, Oct-2011; PackageReference: RGT16-1700X1700TP; PackageDescription: 16-Pin Plastic Quad Flat No-Lead, 3 x 3 mm Body, 0.5 mm Pitch, 1.7 x 1.7 mm Exposed Pad; Supplier 1: Digi-Key; Supplier Part Number 1: 296-29940-2-ND; Supplier 2: Digi-Key; Supplier Part Number 2: 296-29940-1-ND; Supplier 3: Digi-Key; Supplier Part Number 3: 296-29940-6-ND; Supplier 4: Newark; Supplier Part Number 4: 74T5540; Supplier 5: Mouser; Supplier Part Number 5: 595-TPS62142RGTT; Eco-Plan: Green (RoHS & no Sb/Br); Topology: Buck; Vin(Min)(V): 3; Vout(Max)(V): 3.3; Vout(Min)(V): 3.3; Mounting Technology: Surface Mount; Code_JEDEC: MO-220; PartNumber: TPS62142RGTT; ComponentLink1Description: Datasheet; ComponentLink1URL: http://www.ti.com/general/docs/lit/getliterature.tsp?genericPartNumber=TPS62142&fileType=pdf; ComponentLink2Description: Package Specification; ComponentLink2URL: http://www.ti.com/litv/pdf/mpqf119g; ComponentLink3Description: URL Link1; ComponentLink3URL: Samples URL:http://www.ti.com/product/tps54611#samples

## Sheet Thermocouple Channel.SchDoc
size A
Used 2 times, as channels Thermocouple Channel1, Thermocouple Channel2. Parts and nets are listed once, with the designators drawn on the sheet.
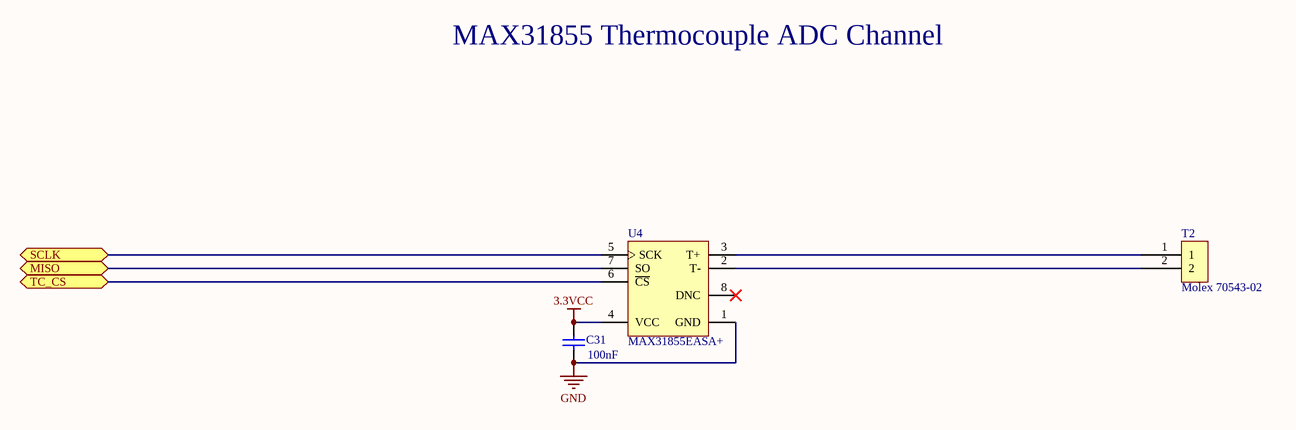
[diagram p4: Thermocouple Channel.SchDoc]

### Parts
C31  value 100nF  [1608[0603]]  (hidden comment: Cap Semi)
T2  Molex 70543-02  [70543-02]
U4  MAX31855EASA+  [MAXM-S8+4_N]

### Ports
MISO, SCLK, TC_CS

### Nets
3.3VCC: C31.2 U4.4(VCC)
GND: C31.1 U4.1(GND)
MISO: U4.7(SO) ; port MISO
SCLK: U4.5(SCK) ; port SCLK
TC_CS: U4.6(~{CS}) ; port TC_CS
NetT2_1: T2.1 U4.3(T+)
NetT2_2: T2.2 U4.2(T-)

Not connected (* = marked no-connect by the designer): U4 8(DNC)*

### Channels
Thermocouple Channel1: designators end in _ThermocoupleChannel1; ports MISO=MISO SCLK=SCLK TC_CS=TC_CS1
Thermocouple Channel2: designators end in _ThermocoupleChannel2; ports MISO=MISO SCLK=SCLK TC_CS=TC_CS2

### Notes on the sheet
- MAX31855 Thermocouple ADC Channel

### Library data of the parts
C31 = Cap Semi: Capacitor (Semiconductor SIM Model); Published: 8-Jun-2000; LatestRevisionDate: 29-May-2009; LatestRevisionNote: IPC-7351 Footprint Added.; PackageReference: C1206; Publisher: Altium Limited; PackageDescription: Chip Capacitor
U4 = MAX31855EASA+: Cold Junction Compensated Thermocouple to Digital Converter, 14 Bits Temperature Resolution, -40 to 125 degC, 8-Pin SOIC (S8+4), Pb-Free; Functions: Thermocouple-to-Digital Converter; Interface: SPI; Parasite Pwr.: No; DatasheetVersion: Rev. 2; PackageVersion: Rev. D, 10/2012; PackageReference: S8+4; PackageDescription: 8-Pin Small-Outline IC, Narrow, Body 3.9 x 4.9 mm, Pitch 1.27 mm; Supplier 1: Digi-Key; Supplier Part Number 1: MAX31855EASA+-ND; Supplier 2: Mouser; Supplier Part Number 2: 700-MAX31855EASA+; Generic Part Number: MAX31855; Mounting Technology: Surface Mount; Code_JEDEC: MS-012; PartNumber: MAX31855EASA+; ComponentLink1Description: Manufacturer URL; ComponentLink1URL: http://www.maximintegrated.com/; ComponentLink2Description: Datasheet; ComponentLink2URL: http://datasheets.maximintegrated.com/en/ds/MAX31855.pdf; ComponentLink3Description: Package Specification; ComponentLink3URL: http://pdfserv.maximintegrated.com/package_dwgs/21-0041.PDF

## Sheet Endstop Channel.SchDoc
size A
Used 3 times, as channels Endstop Channel1, Endstop Channel2, Endstop Channel3. Parts and nets are listed once, with the designators drawn on the sheet.
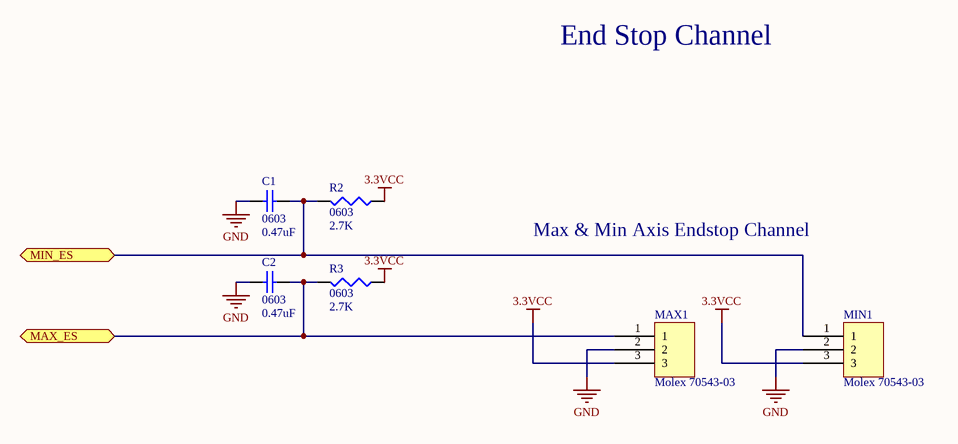
[diagram p5: Endstop Channel.SchDoc]

### Parts
C1  0603  value 0.47uF  [1608[0603]]
C2  0603  value 0.47uF  [1608[0603]]
MAX1  Molex 70543-03  [70543-03]
MIN1  Molex 70543-03  [70543-03]
R2  0603  value 2.7K  [J1-0603]
R3  0603  value 2.7K  [J1-0603]

### Ports
MAX_ES, MIN_ES

### Nets
3.3VCC: MAX1.3 MIN1.3 R2.1 R3.1
GND: C1.2 C2.2 MAX1.2 MIN1.2
MAX_ES: C2.1 MAX1.1 R3.2 ; port MAX_ES
MIN_ES: C1.1 MIN1.1 R2.2 ; port MIN_ES

### Channels
Endstop Channel1: designators end in _EndstopChannel1; ports MAX_ES=MAX_ES1 MIN_ES=MIN_ES1
Endstop Channel2: designators end in _EndstopChannel2; ports MAX_ES=MAX_ES2 MIN_ES=MIN_ES2
Endstop Channel3: designators end in _EndstopChannel3; ports MAX_ES=MAX_ES3 MIN_ES=MIN_ES3

### Notes on the sheet
- End Stop Channel
- Max & Min Axis Endstop Channel

### Library data of the parts
C1 C2 = Cap Semi: Capacitor (Semiconductor SIM Model); Published: 8-Jun-2000; LatestRevisionDate: 29-May-2009; LatestRevisionNote: IPC-7351 Footprint Added.; PackageReference: C1206; Publisher: Altium Limited; PackageDescription: Chip Capacitor
MAX1 MIN1 = Molex Endstop
R2 R3 = Res3: Resistor; Published: 8-Jun-2000; LatestRevisionDate: 29-May-2009; LatestRevisionNote: IPC-7351 Footprint Added.; PackageReference: J1-0603; Publisher: Altium Limited; PackageDescription: Chip Resistor

## Sheet Driver Channel DRV8825.SchDoc
size A
Used 5 times, as channels Driver Channel DRV88251, Driver Channel DRV88252, Driver Channel DRV88253, Driver Channel DRV88254, Driver Channel DRV88255. Parts and nets are listed once, with the designators drawn on the sheet.
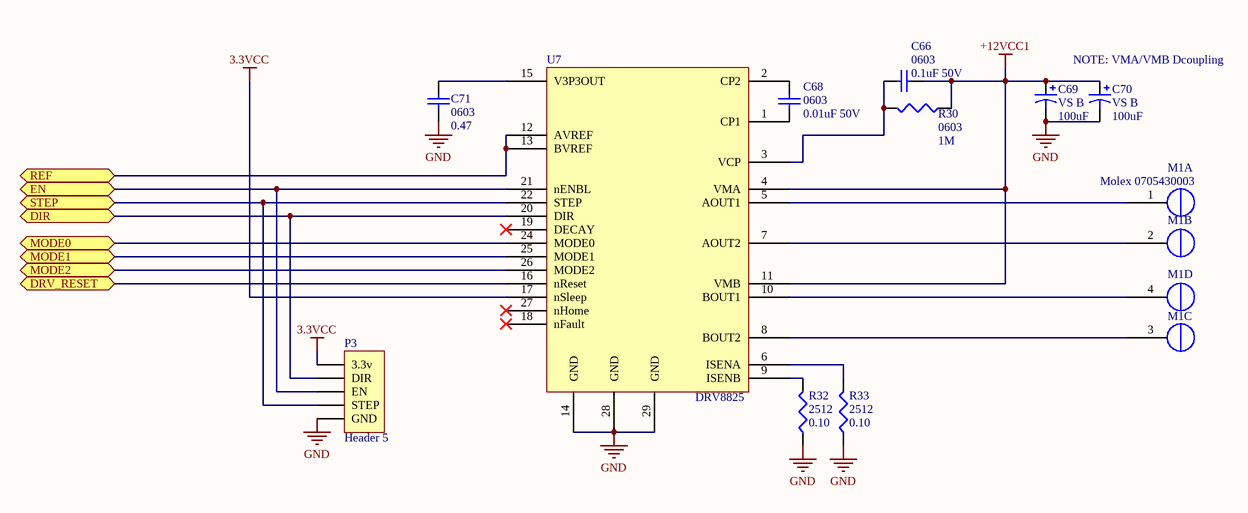
[diagram p6: Driver Channel DRV8825.SchDoc]

### Parts
C66  0603  value 0.1uF 50V  [1608[0603]]
C68  0603  value 0.01uF 50V  [1608[0603]]
C69  VS B  value 100uF  [Panasonic VS B]
C70  VS B  value 100uF  [Panasonic VS B]
C71  0603  value 0.47  [1608[0603]]
M1  Molex 0705430003  [4POL254]  (parts A,B,C,D of 4)
P3  Header 5  [HDR1X5]
R30  0603  value 1M  [J1-0603]
R32  2512  value 0.10  [Resistor2512]
R33  2512  value 0.10  [Resistor2512]
U7  DRV8825  [DRV8825]

### Ports
DIR, DRV_RESET, EN, MODE0, MODE1, MODE2, REF, STEP

### Nets
3.3VCC: P3.1(3.3v) U7.17(nSleep)
+12VCC1: C66.1 C69.1 C70.1 R30.1 U7.4(VMA) U7.11(VMB)
GND: C69.2 C70.2 C71.1 P3.5(GND) R32.1 R33.1 U7.14(GND) U7.28(GND) U7.29(GND)
DIR: P3.2(DIR) U7.20(DIR) ; port DIR
DRV_RESET: U7.16(nReset) ; port DRV_RESET
EN: P3.3(EN) U7.21(nENBL) ; port EN
MODE0: U7.24(MODE0) ; port MODE0
MODE1: U7.25(MODE1) ; port MODE1
MODE2: U7.26(MODE2) ; port MODE2
REF: U7.12(AVREF) U7.13(BVREF) ; port REF
STEP: P3.4(STEP) U7.22(STEP) ; port STEP
NetC66_2: C66.2 R30.2 U7.3(VCP)
NetC68_1: C68.1 U7.1(CP1)
NetC68_2: C68.2 U7.2(CP2)
NetC71_2: C71.2 U7.15(V3P3OUT)
NetM1_1: M1.1(OUT2B) U7.5(AOUT1)
NetM1_2: M1.2(OUT2A) U7.7(AOUT2)
NetM1_3: M1.3(OUT1A) U7.8(BOUT2)
NetM1_4: M1.4(OUT1B) U7.10(BOUT1)
NetR32_2: R32.2 U7.9(ISENB)
NetR33_2: R33.2 U7.6(ISENA)

Not connected (* = marked no-connect by the designer): U7 18(nFault)* 19(DECAY)* 23(NC) 27(nHome)*

### Channels
Driver Channel DRV88251: designators end in _DriverChannelDRV88251; ports DIR=DIR1 DRV_RESET=DRV_RESET1 EN=EN1 MODE0=MOD0E1 MODE1=MOD1E1 MODE2=MOD2E1 REF=REF1 STEP=STEP1
Driver Channel DRV88252: designators end in _DriverChannelDRV88252; ports DIR=DIR2 DRV_RESET=DRV_RESET2 EN=EN2 MODE0=MOD0E2 MODE1=MOD1E2 MODE2=MOD2E2 REF=REF2 STEP=STEP2
Driver Channel DRV88253: designators end in _DriverChannelDRV88253; ports DIR=DIR3 DRV_RESET=DRV_RESET3 EN=EN3 MODE0=MOD0E3 MODE1=MOD1E3 MODE2=MOD2E3 REF=REF3 STEP=STEP3
Driver Channel DRV88254: designators end in _DriverChannelDRV88254; ports DIR=DIR4 DRV_RESET=DRV_RESET4 EN=EN4 MODE0=MOD0E4 MODE1=MOD1E4 MODE2=MOD2E4 REF=REF4 STEP=STEP4
Driver Channel DRV88255: designators end in _DriverChannelDRV88255; ports DIR=DIR5 DRV_RESET=DRV_RESET5 EN=EN5 MODE0=MOD0E5 MODE1=MOD1E5 MODE2=MOD2E5 REF=REF5 STEP=STEP5

### Notes on the sheet
- NOTE: VMA/VMB Dcoupling

### Library data of the parts
C66 C68 C71 = Cap Semi: Capacitor (Semiconductor SIM Model); Published: 8-Jun-2000; LatestRevisionDate: 29-May-2009; LatestRevisionNote: IPC-7351 Footprint Added.; PackageReference: C1206; Publisher: Altium Limited; PackageDescription: Chip Capacitor
C69 C70 = Cap Pol1: Polarized Capacitor (Radial); Published: 8-Jun-2000; LatestRevisionDate: 17-Jul-2002; LatestRevisionNote: Re-released for DXP Platform.; PackageReference: RB7.6-15; Publisher: Altium Limited; PackageDescription: Polarized Capacitor (Radial); 2 Leads
M1 = Molex 0705430003 Alt: Molex 4 Pin Clip Connector
P3 = Header 5: Header, 5-Pin; LatestRevisionDate: 17-Jul-2002; LatestRevisionNote: Re-released for DXP Platform.; Publisher: Altium Limited
R30 R32 R33 = Res3: Resistor; Published: 8-Jun-2000; LatestRevisionDate: 29-May-2009; LatestRevisionNote: IPC-7351 Footprint Added.; PackageReference: J1-0603; Publisher: Altium Limited; PackageDescription: Chip Resistor
U7 = DRV8825: DRV8825 Ti Stepper Driver

## Sheet MOSFETs and Driver.SchDoc
size B
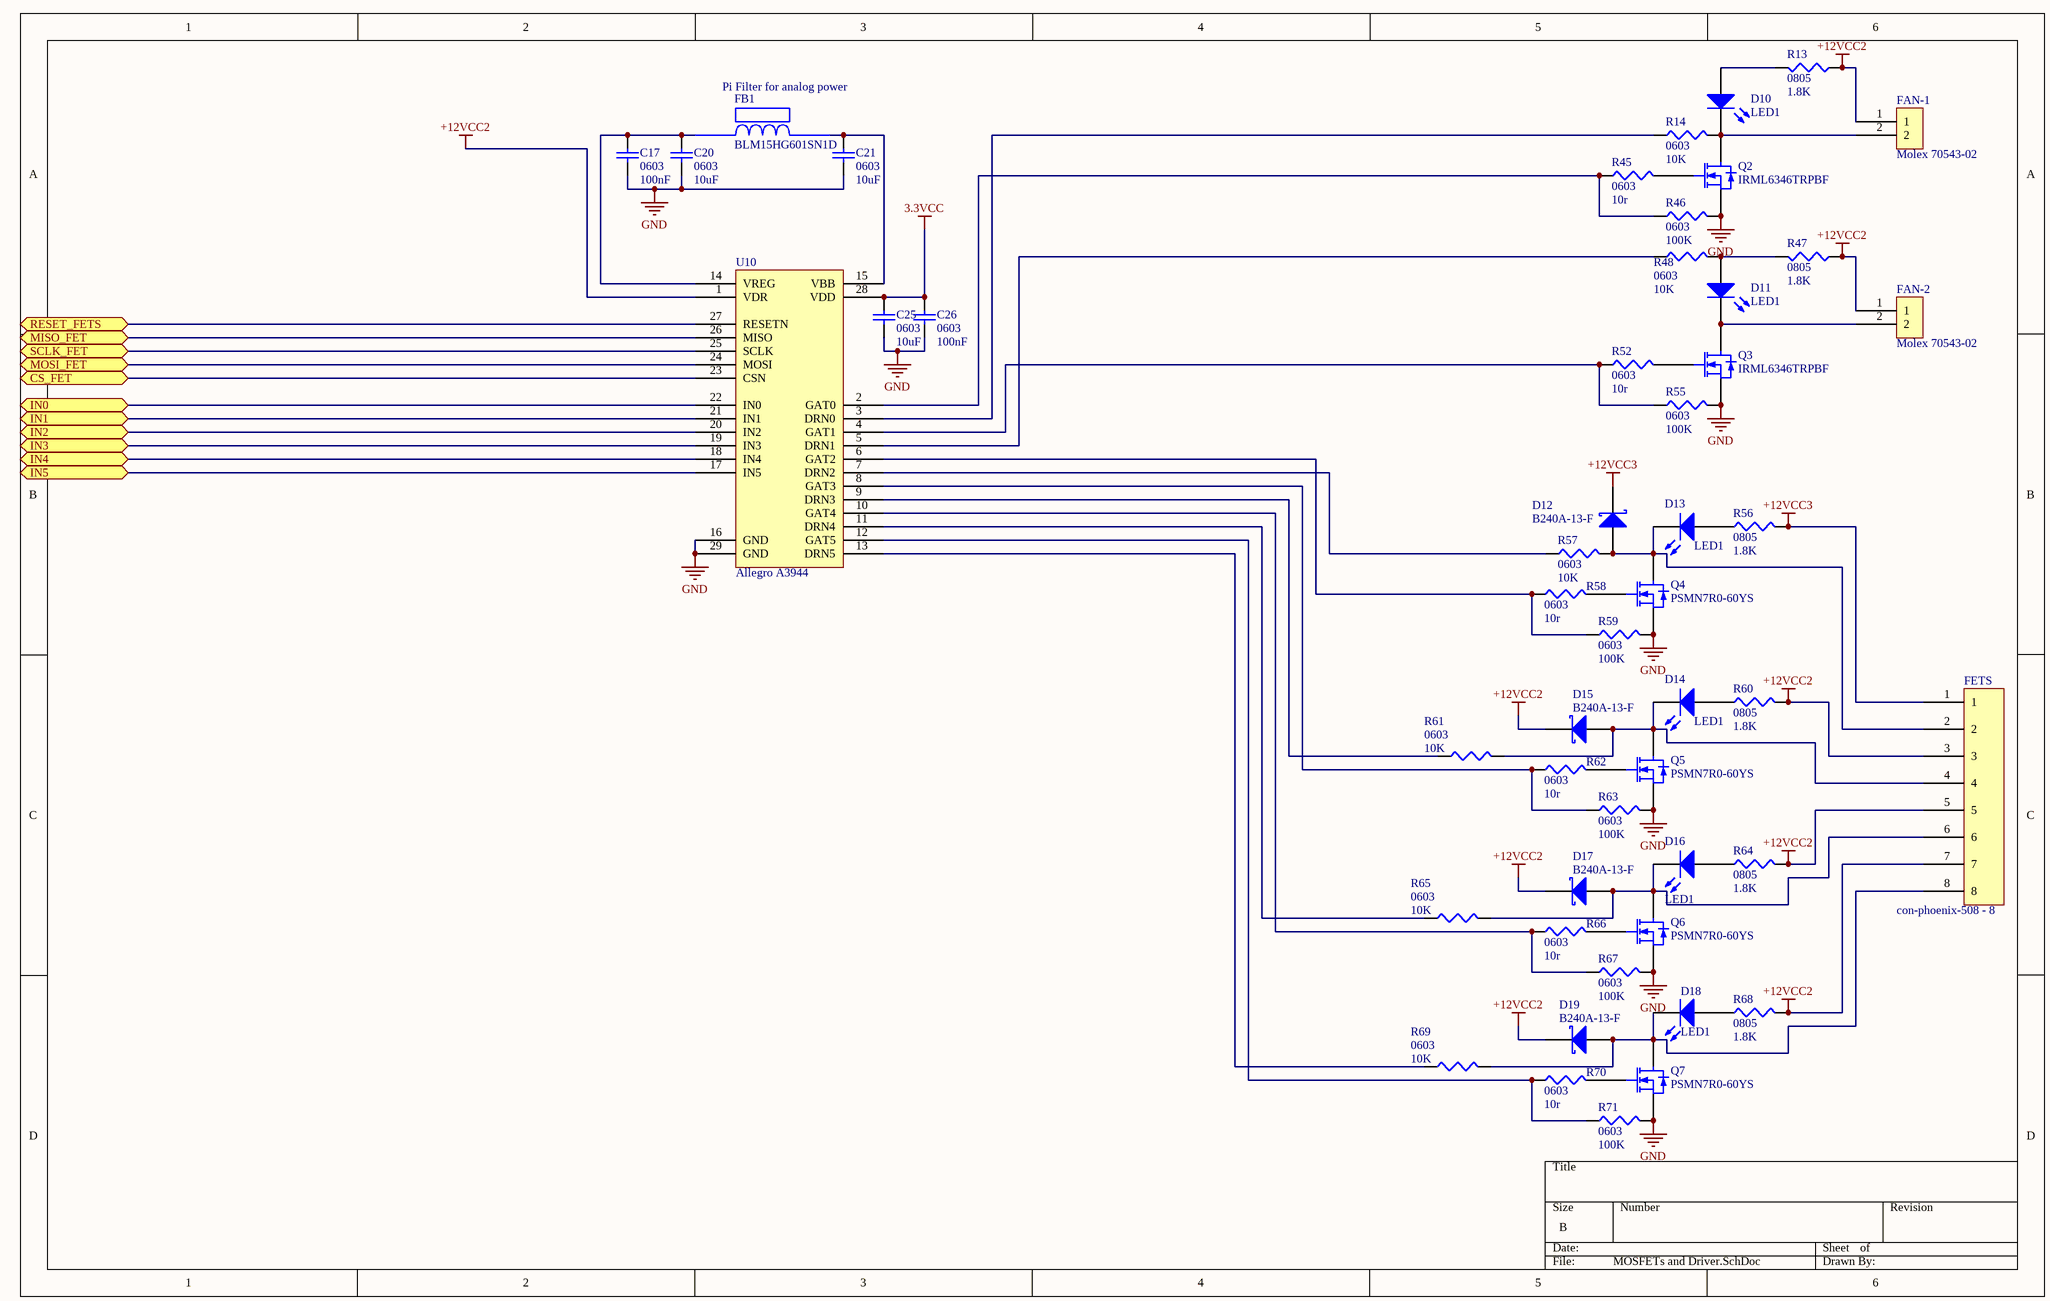
[diagram p7: MOSFETs and Driver.SchDoc]

### Parts
C17  0603  value 100nF  [1608[0603]]
C20  0603  value 10uF  [1608[0603]]
C21  0603  value 10uF  [1608[0603]]
C25  0603  value 10uF  [1608[0603]]
C26  0603  value 100nF  [1608[0603]]
D10  LED1  [SM 0805 polarized]
D11  LED1  [SM 0805 polarized]
D12  B240A-13-F  [SK310A-TP]
D13  LED1  [SM 0805 polarized]
D14  LED1  [SM 0805 polarized]
D15  B240A-13-F  [SK310A-TP]
D16  LED1  [SM 0805 polarized]
D17  B240A-13-F  [SK310A-TP]
D18  LED1  [SM 0805 polarized]
D19  B240A-13-F  [SK310A-TP]
FAN-1  Molex 70543-02  [70543-02]
FAN-2  Molex 70543-02  [70543-02]
FB1  BLM15HG601SN1D  [BLM18PG121SN1D]
FETS  con-phoenix-508 - 8  [MSTBV4]
Q2  IRML6346TRPBF  [IRLML6346]
Q3  IRML6346TRPBF  [IRLML6346]
Q4  PSMN7R0-60YS  [PSMN7R0-60YS]
Q5  PSMN7R0-60YS  [PSMN7R0-60YS]
Q6  PSMN7R0-60YS  [PSMN7R0-60YS]
Q7  PSMN7R0-60YS  [PSMN7R0-60YS]
R13  0805  value 1.8K  [SM 0805 - gap trimmed]
R14  0603  value 10K  [J1-0603]
R45  0603  value 10r  [J1-0603]
R46  0603  value 100K  [J1-0603]
R47  0805  value 1.8K  [SM 0805 - gap trimmed]
R48  0603  value 10K  [J1-0603]
R52  0603  value 10r  [J1-0603]
R55  0603  value 100K  [J1-0603]
R56  0805  value 1.8K  [SM 0805 - gap trimmed]
R57  0603  value 10K  [J1-0603]
R58  0603  value 10r  [J1-0603]
R59  0603  value 100K  [J1-0603]
R60  0805  value 1.8K  [SM 0805 - gap trimmed]
R61  0603  value 10K  [J1-0603]
R62  0603  value 10r  [J1-0603]
R63  0603  value 100K  [J1-0603]
R64  0805  value 1.8K  [SM 0805 - gap trimmed]
R65  0603  value 10K  [J1-0603]
R66  0603  value 10r  [J1-0603]
R67  0603  value 100K  [J1-0603]
R68  0805  value 1.8K  [SM 0805 - gap trimmed]
R69  0603  value 10K  [J1-0603]
R70  0603  value 10r  [J1-0603]
R71  0603  value 100K  [J1-0603]
U10  Allegro A3944  [A3944 28 Pin TSSOP]

### Ports
CS_FET, IN0, IN1, IN2, IN3, IN4, IN5, MISO_FET, MOSI_FET, RESET_FETS, SCLK_FET

### Nets
3.3VCC: C25.2 C26.1 U10.28(VDD)
+12VCC2: D15.2(K) D17.2(K) D19.2(K) FAN-1.1 FAN-2.1 FETS.3 FETS.5 FETS.7 R13.1 R47.1 R60.2 R64.2 R68.2 U10.1(VDR)
+12VCC3: D12.2(K) FETS.1 R56.2
GND: C17.2 C20.1 C21.1 C25.1 C26.2 Q2.2(S) Q3.2(S) Q4.1(S) Q4.2(S) Q4.3(S) Q5.1(S) Q5.2(S) Q5.3(S) Q6.1(S) Q6.2(S) Q6.3(S) Q7.1(S) Q7.2(S) Q7.3(S) R46.2 R55.2 R59.2 R63.2 R67.2 R71.2 U10.16(GND) U10.29(GND)
BED_PWM: U10.17(IN5) ; port IN5
CPC_MISO: U10.26(MISO) ; port MISO_FET
CPC_MOSI: U10.24(MOSI) ; port MOSI_FET
CPC_SCLK: U10.25(SCLK) ; port SCLK_FET
FET_PWM1: U10.22(IN0) ; port IN0
FET_PWM2: U10.21(IN1) ; port IN1
FET_PWM3: U10.20(IN2) ; port IN2
FET_PWM4: U10.19(IN3) ; port IN3
FET_PWM5: U10.18(IN4) ; port IN4
FET_RESET: U10.27(RESETN) ; port RESET_FETS
NetC17_1: C17.1 C20.2 FB1.1 U10.14(VREG)
NetC21_2: C21.2 FB1.2 U10.15(VBB)
NetD10_1: D10.1(A) FAN-1.2 Q2.3(D) R14.2
NetD10_2: D10.2(K) R13.2
NetD11_1: D11.1(A) FAN-2.2 Q3.3(D)
NetD11_2: D11.2(K) R47.2 R48.2
NetD12_1: D12.1(A) D13.1(A) FETS.2 Q4.5(D) R57.2
NetD13_2: D13.2(K) R56.1
NetD14_1: D14.1(A) D15.1(A) FETS.4 Q5.5(D) R61.2
NetD14_2: D14.2(K) R60.1
NetD16_1: D16.1(A) D17.1(A) FETS.6 Q6.5(D) R65.2
NetD16_2: D16.2(K) R64.1
NetD18_1: D18.1(A) D19.1(A) FETS.8 Q7.5(D) R69.2
NetD18_2: D18.2(K) R68.1
NetQ2_1: Q2.1(G) R45.2
NetQ3_1: Q3.1(G) R52.2
NetQ4_4: Q4.4(G) R58.2
NetQ5_4: Q5.4(G) R62.2
NetQ6_4: Q6.4(G) R66.2
NetQ7_4: Q7.4(G) R70.2
NetR14_1: R14.1 U10.3(DRN0)
NetR45_1: R45.1 R46.1 U10.2(GAT0)
NetR48_1: R48.1 U10.5(DRN1)
NetR52_1: R52.1 R55.1 U10.4(GAT1)
NetR57_1: R57.1 U10.7(DRN2)
NetR58_1: R58.1 R59.1 U10.6(GAT2)
NetR61_1: R61.1 U10.9(DRN3)
NetR62_1: R62.1 R63.1 U10.8(GAT3)
NetR65_1: R65.1 U10.11(DRN4)
NetR66_1: R66.1 R67.1 U10.10(GAT4)
NetR69_1: R69.1 U10.13(DRN5)
NetR70_1: R70.1 R71.1 U10.12(GAT5)
NetU10_23: U10.23(CSN) ; port CS_FET

### Notes on the sheet
- Pi Filter for analog power

### Library data of the parts
C17 C20 C21 C25 C26 = Cap Semi: Capacitor (Semiconductor SIM Model); Published: 8-Jun-2000; LatestRevisionDate: 29-May-2009; LatestRevisionNote: IPC-7351 Footprint Added.; PackageReference: C1206; Publisher: Altium Limited; PackageDescription: Chip Capacitor
D10 D11 D13 D14 D16 D18 = LED1: Typical RED GaAs LED; Published: 8-Jun-2000; LatestRevisionDate: 08-Jul-2005; LatestRevisionNote: Mech Layer 1 removed.; PackageReference: LED-1; Publisher: Altium Limited; PackageDescription: LED; 2 Leads
D12 D15 D17 D19 = D Schottky: Schottky Diode; Published: 8-Jun-2000; LatestRevisionDate: 17-Jul-2002; LatestRevisionNote: Re-released for DXP Platform.; PackageReference: SMB; Publisher: Altium Limited; PackageDescription: DO-214-AA/SMB; 2 C-Bend Leads; Body 5.3 x 3.6 mm, inc. leads (LxW); Code_JEDEC: DO-214-AA
FETS = con-phoenix-508
Q2 Q3 = IRML6346TRPBF: N-Channel MOSFET; Published: 8-Jun-2000; LatestRevisionDate: 17-Jul-2002; LatestRevisionNote: Re-released for DXP Platform.; PackageVersion: 1995/1996; PackageReference: E3; Publisher: Altium Limited; PackageDescription: TO, Flat Index; 3 In-Line, Axial Leads; Body Dia. 4.6mm; Lead Dia. 0.5 mm (max)
Q4-Q7 = PSMN7R0-60YS: N-Channel MOSFET; Published: 8-Jun-2000; LatestRevisionDate: 17-Jul-2002; LatestRevisionNote: Re-released for DXP Platform.; PackageVersion: 1995/1996; PackageReference: E3; Publisher: Altium Limited; PackageDescription: TO, Flat Index; 3 In-Line, Axial Leads; Body Dia. 4.6mm; Lead Dia. 0.5 mm (max)
R13 R14 R45-R48 R52 R55-R71 = Res3: Resistor; Published: 8-Jun-2000; LatestRevisionDate: 29-May-2009; LatestRevisionNote: IPC-7351 Footprint Added.; PackageReference: J1-0603; Publisher: Altium Limited; PackageDescription: Chip Resistor
U10 = A3944 - MOSFET Low Side Driver: Allegro Micro A3944 MOST Driver (low side)

## Sheet ATSAMD21G18 CoProcessor.SchDoc
size A
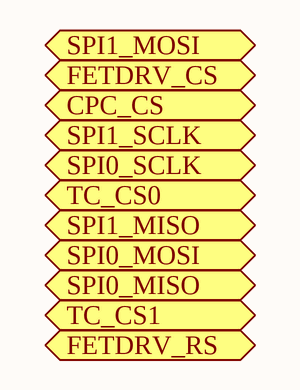
[diagram p8: ATSAMD21G18 CoProcessor.SchDoc]

### Ports
CPC_CS, FETDRV_CS, FETDRV_RS, SPI0_MISO, SPI0_MOSI, SPI0_SCLK, SPI1_MISO, SPI1_MOSI, SPI1_SCLK, TC_CS0, TC_CS1

## Nets that join several sheets
3.3VCC: ATSAM4E16EA_AU Main Controller (32 pins), Thermistor Channel1 (R13_ThermistorChannel1.2), Thermistor Channel2 (R13_ThermistorChannel2.2), Power (C23.1 C35.1 FB3.2 R11.2), Thermocouple Channel1 (C31_ThermocoupleChannel1.2 U4_ThermocoupleChannel1.4), Thermocouple Channel2 (C31_ThermocoupleChannel2.2 U4_ThermocoupleChannel2.4), Endstop Channel1 (MAX1_EndstopChannel1.3 MIN1_EndstopChannel1.3 R2_EndstopChannel1.1 R3_EndstopChannel1.1), Endstop Channel2 (MAX1_EndstopChannel2.3 MIN1_EndstopChannel2.3 R2_EndstopChannel2.1 R3_EndstopChannel2.1), Endstop Channel3 (MAX1_EndstopChannel3.3 MIN1_EndstopChannel3.3 R2_EndstopChannel3.1 R3_EndstopChannel3.1), Driver Channel DRV88251 (P3_DriverChannelDRV88251.1 U7_DriverChannelDRV88251.17), Driver Channel DRV88252 (P3_DriverChannelDRV88252.1 U7_DriverChannelDRV88252.17), Driver Channel DRV88253 (P3_DriverChannelDRV88253.1 U7_DriverChannelDRV88253.17), Driver Channel DRV88254 (P3_DriverChannelDRV88254.1 U7_DriverChannelDRV88254.17), Driver Channel DRV88255 (P3_DriverChannelDRV88255.1 U7_DriverChannelDRV88255.17), MOSFETs and Driver (C25.2 C26.1 U10.28)
+12VCC1: Power (10 pins), Driver Channel DRV88251 (6 pins), Driver Channel DRV88252 (6 pins), Driver Channel DRV88253 (6 pins), Driver Channel DRV88254 (6 pins), Driver Channel DRV88255 (6 pins)
+12VCC2: Power (6 pins), MOSFETs and Driver (14 pins)
+12VCC3: Power (5 pins), MOSFETs and Driver (D12.2 FETS.1 R56.2)
GND: ATSAM4E16EA_AU Main Controller (50 pins), Thermistor Channel1 (C30_ThermistorChannel1.1 D12_ThermistorChannel1.1 P2_ThermistorChannel1.2), Thermistor Channel2 (C30_ThermistorChannel2.1 D12_ThermistorChannel2.1 P2_ThermistorChannel2.2), Power (43 pins), Thermocouple Channel1 (C31_ThermocoupleChannel1.1 U4_ThermocoupleChannel1.1), Thermocouple Channel2 (C31_ThermocoupleChannel2.1 U4_ThermocoupleChannel2.1), Endstop Channel1 (C1_EndstopChannel1.2 C2_EndstopChannel1.2 MAX1_EndstopChannel1.2 MIN1_EndstopChannel1.2), Endstop Channel2 (C1_EndstopChannel2.2 C2_EndstopChannel2.2 MAX1_EndstopChannel2.2 MIN1_EndstopChannel2.2), Endstop Channel3 (C1_EndstopChannel3.2 C2_EndstopChannel3.2 MAX1_EndstopChannel3.2 MIN1_EndstopChannel3.2), Driver Channel DRV88251 (9 pins), Driver Channel DRV88252 (9 pins), Driver Channel DRV88253 (9 pins), Driver Channel DRV88254 (9 pins), Driver Channel DRV88255 (9 pins), MOSFETs and Driver (27 pins)
BED_PWM: ATSAM4E16EA_AU Main Controller (U5.52), MOSFETs and Driver (U10.17)
DIR1: ATSAM4E16EA_AU Main Controller (U5.78), Driver Channel DRV88251 (P3_DriverChannelDRV88251.2 U7_DriverChannelDRV88251.20)
DIR2: ATSAM4E16EA_AU Main Controller (U5.93), Driver Channel DRV88252 (P3_DriverChannelDRV88252.2 U7_DriverChannelDRV88252.20)
DIR3: ATSAM4E16EA_AU Main Controller (U5.102), Driver Channel DRV88253 (P3_DriverChannelDRV88253.2 U7_DriverChannelDRV88253.20)
DIR4: ATSAM4E16EA_AU Main Controller (U5.113), Driver Channel DRV88254 (P3_DriverChannelDRV88254.2 U7_DriverChannelDRV88254.20)
DIR5: ATSAM4E16EA_AU Main Controller (U5.121), Driver Channel DRV88255 (P3_DriverChannelDRV88255.2 U7_DriverChannelDRV88255.20)
DRV_RESET1: ATSAM4E16EA_AU Main Controller (U5.82), Driver Channel DRV88251 (U7_DriverChannelDRV88251.16)
DRV_RESET2: ATSAM4E16EA_AU Main Controller (U5.94), Driver Channel DRV88252 (U7_DriverChannelDRV88252.16)
DRV_RESET3: ATSAM4E16EA_AU Main Controller (U5.103), Driver Channel DRV88253 (U7_DriverChannelDRV88253.16)
DRV_RESET4: ATSAM4E16EA_AU Main Controller (U5.114), Driver Channel DRV88254 (U7_DriverChannelDRV88254.16)
DRV_RESET5: ATSAM4E16EA_AU Main Controller (U5.122), Driver Channel DRV88255 (U7_DriverChannelDRV88255.16)
EN1: ATSAM4E16EA_AU Main Controller (U5.76), Driver Channel DRV88251 (P3_DriverChannelDRV88251.3 U7_DriverChannelDRV88251.21)
EN2: ATSAM4E16EA_AU Main Controller (U5.92), Driver Channel DRV88252 (P3_DriverChannelDRV88252.3 U7_DriverChannelDRV88252.21)
EN3: ATSAM4E16EA_AU Main Controller (U5.101), Driver Channel DRV88253 (P3_DriverChannelDRV88253.3 U7_DriverChannelDRV88253.21)
EN4: ATSAM4E16EA_AU Main Controller (U5.112), Driver Channel DRV88254 (P3_DriverChannelDRV88254.3 U7_DriverChannelDRV88254.21)
EN5: ATSAM4E16EA_AU Main Controller (U5.120), Driver Channel DRV88255 (P3_DriverChannelDRV88255.3 U7_DriverChannelDRV88255.21)
FET_PWM1: ATSAM4E16EA_AU Main Controller (U5.65), MOSFETs and Driver (U10.22)
FET_PWM2: ATSAM4E16EA_AU Main Controller (U5.63), MOSFETs and Driver (U10.21)
FET_PWM3: ATSAM4E16EA_AU Main Controller (U5.60), MOSFETs and Driver (U10.20)
FET_PWM4: ATSAM4E16EA_AU Main Controller (U5.57), MOSFETs and Driver (U10.19)
FET_PWM5: ATSAM4E16EA_AU Main Controller (U5.55), MOSFETs and Driver (U10.18)
FET_RESET: ATSAM4E16EA_AU Main Controller (U5.38), MOSFETs and Driver (U10.27)
MAX_ES1: ATSAM4E16EA_AU Main Controller (U5.22), Endstop Channel1 (C2_EndstopChannel1.1 MAX1_EndstopChannel1.1 R3_EndstopChannel1.2)
MAX_ES2: ATSAM4E16EA_AU Main Controller (U5.26), Endstop Channel2 (C2_EndstopChannel2.1 MAX1_EndstopChannel2.1 R3_EndstopChannel2.2)
MAX_ES3: ATSAM4E16EA_AU Main Controller (U5.24), Endstop Channel3 (C2_EndstopChannel3.1 MAX1_EndstopChannel3.1 R3_EndstopChannel3.2)
MIN_ES1: ATSAM4E16EA_AU Main Controller (U5.23), Endstop Channel1 (C1_EndstopChannel1.1 MIN1_EndstopChannel1.1 R2_EndstopChannel1.2)
MIN_ES2: ATSAM4E16EA_AU Main Controller (U5.27), Endstop Channel2 (C1_EndstopChannel2.1 MIN1_EndstopChannel2.1 R2_EndstopChannel2.2)
MIN_ES3: ATSAM4E16EA_AU Main Controller (U5.25), Endstop Channel3 (C1_EndstopChannel3.1 MIN1_EndstopChannel3.1 R2_EndstopChannel3.2)
MISO: ATSAM4E16EA_AU Main Controller (EXP0.19 U5.68), Thermocouple Channel1 (U4_ThermocoupleChannel1.7), Thermocouple Channel2 (U4_ThermocoupleChannel2.7)
MOD0E1: ATSAM4E16EA_AU Main Controller (U5.74), Driver Channel DRV88251 (U7_DriverChannelDRV88251.24)
MOD0E2: ATSAM4E16EA_AU Main Controller (U5.88), Driver Channel DRV88252 (U7_DriverChannelDRV88252.24)
MOD0E3: ATSAM4E16EA_AU Main Controller (U5.99), Driver Channel DRV88253 (U7_DriverChannelDRV88253.24)
MOD0E4: ATSAM4E16EA_AU Main Controller (U5.110), Driver Channel DRV88254 (U7_DriverChannelDRV88254.24)
MOD0E5: ATSAM4E16EA_AU Main Controller (U5.118), Driver Channel DRV88255 (U7_DriverChannelDRV88255.24)
MOD1E1: ATSAM4E16EA_AU Main Controller (U5.73), Driver Channel DRV88251 (U7_DriverChannelDRV88251.25)
MOD1E2: ATSAM4E16EA_AU Main Controller (U5.86), Driver Channel DRV88252 (U7_DriverChannelDRV88252.25)
MOD1E3: ATSAM4E16EA_AU Main Controller (U5.98), Driver Channel DRV88253 (U7_DriverChannelDRV88253.25)
MOD1E4: ATSAM4E16EA_AU Main Controller (U5.108), Driver Channel DRV88254 (U7_DriverChannelDRV88254.25)
MOD1E5: ATSAM4E16EA_AU Main Controller (U5.117), Driver Channel DRV88255 (U7_DriverChannelDRV88255.25)
MOD2E1: ATSAM4E16EA_AU Main Controller (U5.71), Driver Channel DRV88251 (U7_DriverChannelDRV88251.26)
MOD2E2: ATSAM4E16EA_AU Main Controller (U5.84), Driver Channel DRV88252 (U7_DriverChannelDRV88252.26)
MOD2E3: ATSAM4E16EA_AU Main Controller (U5.97), Driver Channel DRV88253 (U7_DriverChannelDRV88253.26)
MOD2E4: ATSAM4E16EA_AU Main Controller (U5.106), Driver Channel DRV88254 (U7_DriverChannelDRV88254.26)
MOD2E5: ATSAM4E16EA_AU Main Controller (U5.116), Driver Channel DRV88255 (U7_DriverChannelDRV88255.26)
NetC56_2: ATSAM4E16EA_AU Main Controller (C56.2 U6.14), Power (Logic_Source1.1)
OVREF: Thermistor Channel1 (D11_ThermistorChannel1.2), Thermistor Channel2 (D11_ThermistorChannel2.2), Power (D1.2 R1.1)
SCLK: ATSAM4E16EA_AU Main Controller (EXP0.3 U5.51), Thermocouple Channel1 (U4_ThermocoupleChannel1.5), Thermocouple Channel2 (U4_ThermocoupleChannel2.5)
STEP1: ATSAM4E16EA_AU Main Controller (U5.75), Driver Channel DRV88251 (P3_DriverChannelDRV88251.4 U7_DriverChannelDRV88251.22)
STEP2: ATSAM4E16EA_AU Main Controller (U5.90), Driver Channel DRV88252 (P3_DriverChannelDRV88252.4 U7_DriverChannelDRV88252.22)
STEP3: ATSAM4E16EA_AU Main Controller (U5.100), Driver Channel DRV88253 (P3_DriverChannelDRV88253.4 U7_DriverChannelDRV88253.22)
STEP4: ATSAM4E16EA_AU Main Controller (U5.111), Driver Channel DRV88254 (P3_DriverChannelDRV88254.4 U7_DriverChannelDRV88254.22)
STEP5: ATSAM4E16EA_AU Main Controller (U5.119), Driver Channel DRV88255 (P3_DriverChannelDRV88255.4 U7_DriverChannelDRV88255.22)
THERM_AN1: ATSAM4E16EA_AU Main Controller (U5.17), Thermistor Channel1 (5 pins)
THERM_AN2: ATSAM4E16EA_AU Main Controller (U5.19), Thermistor Channel2 (5 pins)